# EAGLE schematic vehicle_control_module (EAGLE 9.5.2), part 1 of 2

## Sheet 1 of 16
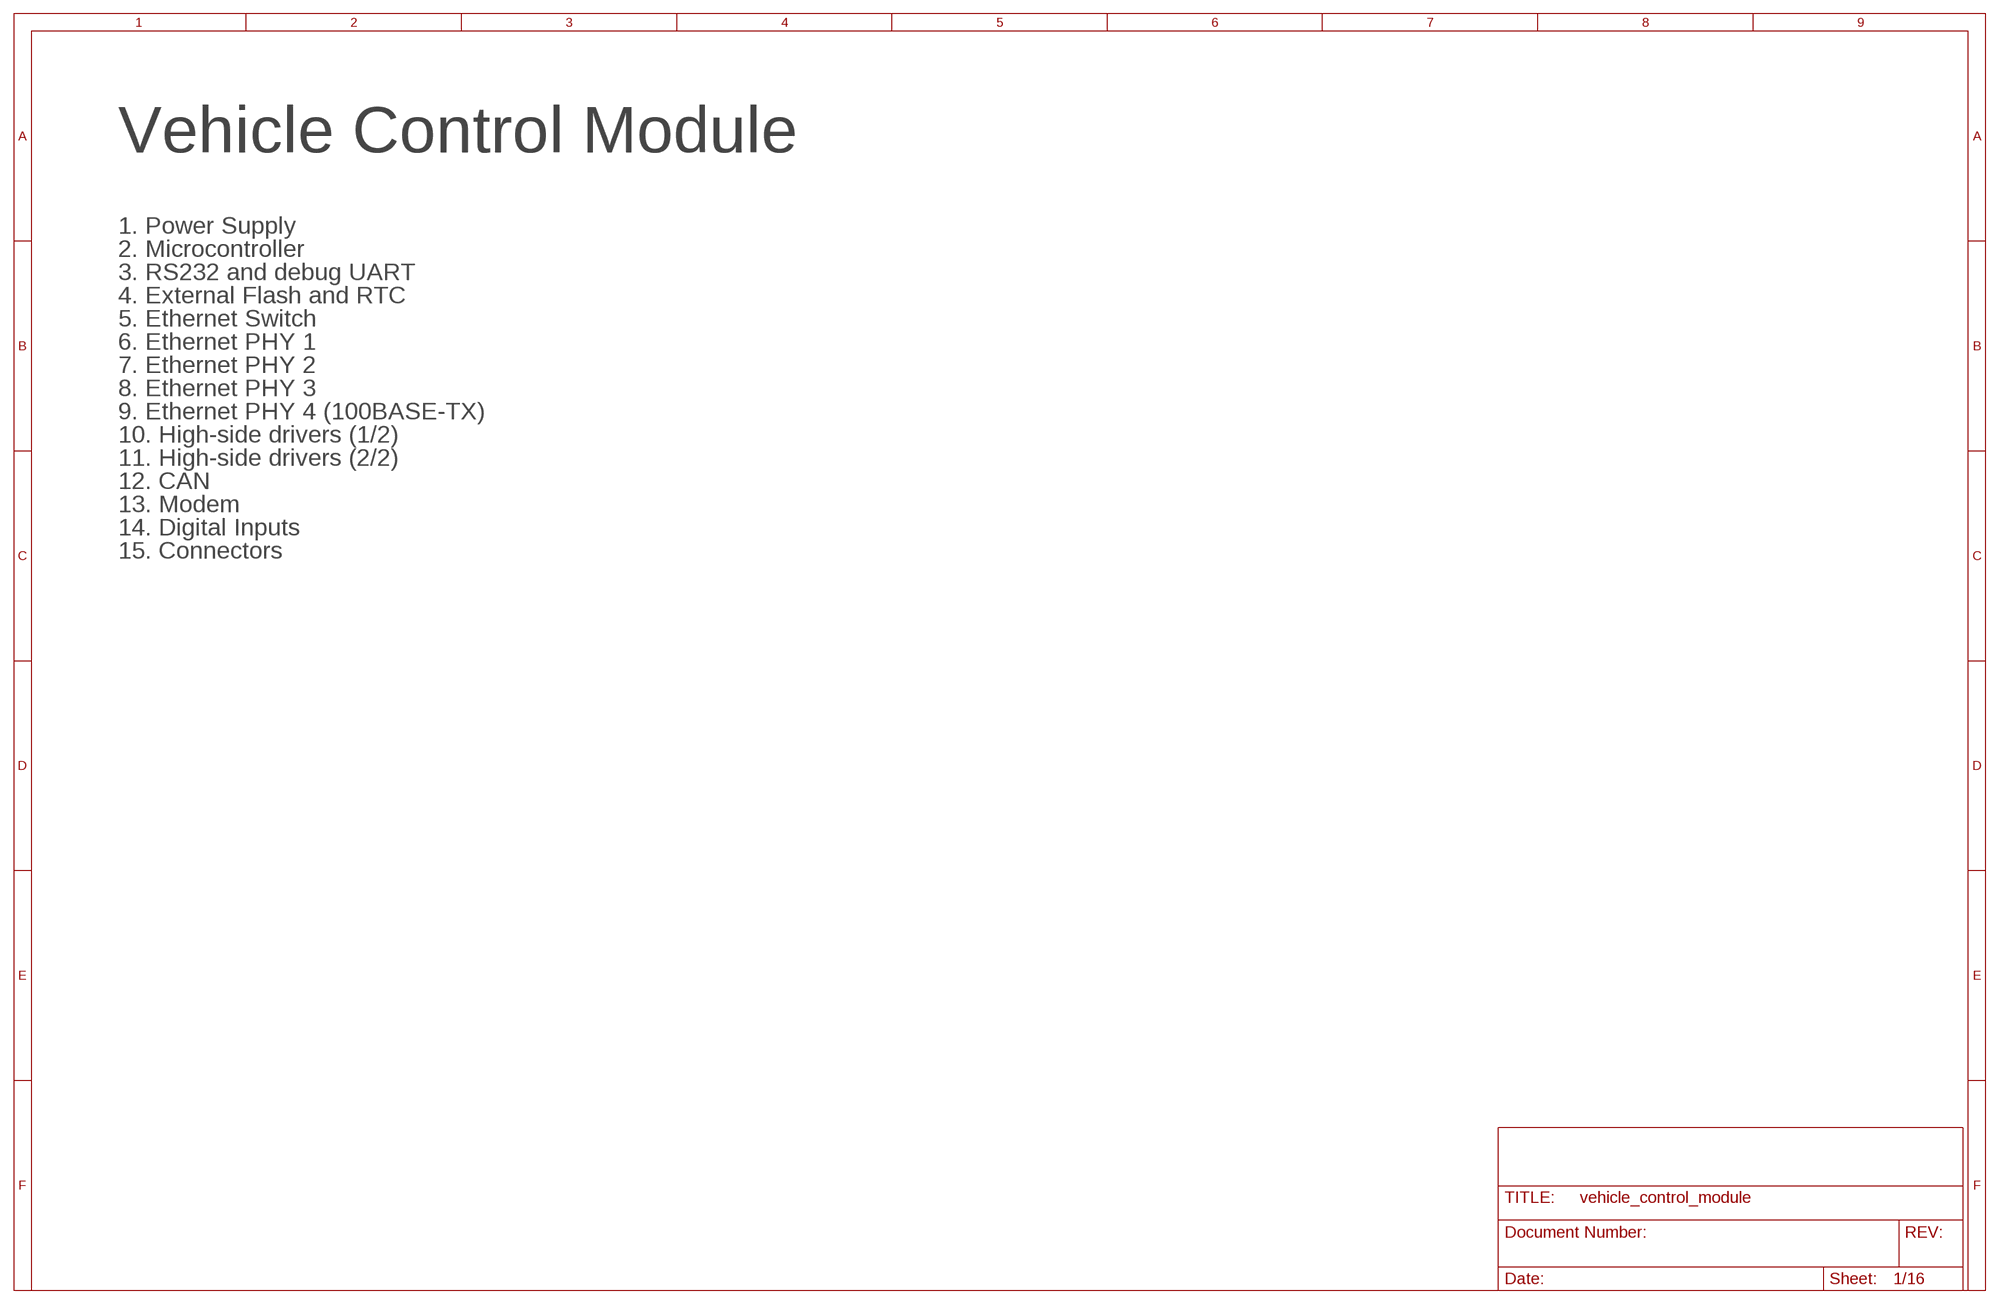
[diagram p0: schematic, sheet 1]

### Notes on the sheet
- Vehicle Control Module
- 1. Power Supply
- 2. Microcontroller
- 3. RS232 and debug UART
- 4. External Flash and RTC
- 5. Ethernet Switch
- 6. Ethernet PHY 1
- 7. Ethernet PHY 2
- 8. Ethernet PHY 3
- 9. Ethernet PHY 4 (100BASE-TX)
- 10. High-side drivers (1/2)
- 11. High-side drivers (2/2)
- 12. CAN
- 13. Modem
- 14. Digital Inputs
- 15. Connectors

## Sheet 2 of 16
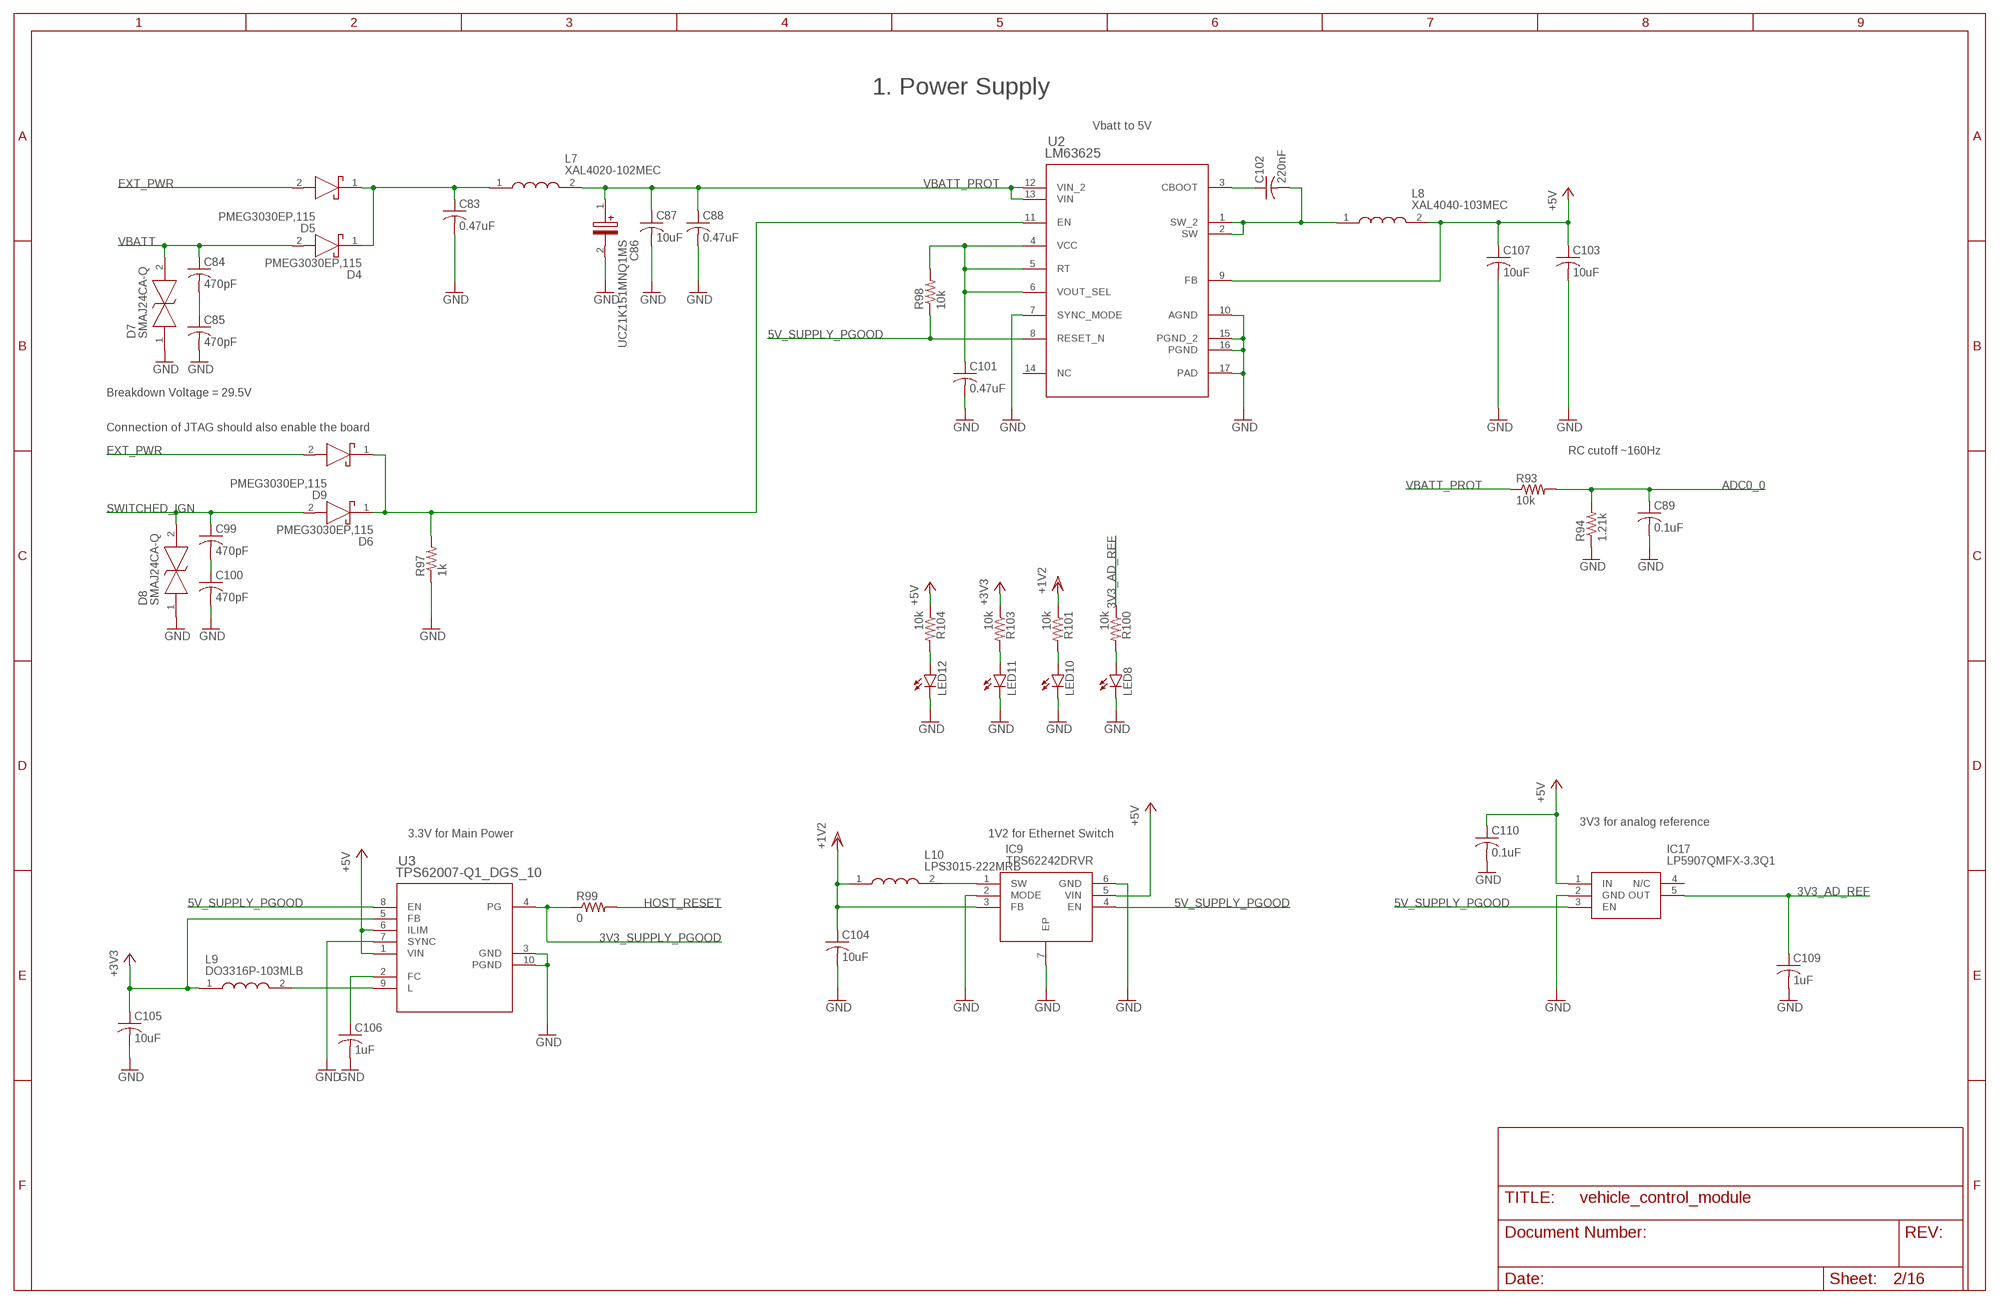
[diagram p1: schematic, sheet 2]

### Parts
C83  0.47uF  C-USC0805  [C0805]
C84  470pF  C-USC0805  [C0805]
C85  470pF  C-USC0805  [C0805]
C86  UCZ1K151MNQ1MS  [CAPAE1360X1450N]
C87  10uF  C-USC0805  [C0805]
C88  0.47uF  C-USC0805  [C0805]
C89  0.1uF  C-USC0603  [C0603]
C99  470pF  C-USC0805  [C0805]
C100  470pF  C-USC0805  [C0805]
C101  0.47uF  C-USC0603  [C0603]
C102  220nF  C-USC0805  [C0805]
C103  10uF  C-USC0805  [C0805]
C104  10uF  C-USC0805  [C0805]
C105  10uF  C-USC0805  [C0805]
C106  1uF  C-USC0603  [C0603]
C107  10uF  C-USC0805  [C0805]
C109  1uF  C-USC0603  [C0603]
C110  0.1uF  C-USC0603  [C0603]
D4  PMEG3030EP,115  [SODFL4725X110N]
D5  PMEG3030EP,115  [SODFL4725X110N]
D6  PMEG3030EP,115  [SODFL4725X110N]
D7  SMAJ24CA-Q  [DIONM5127X229N]
D8  SMAJ24CA-Q  [DIONM5127X229N]
D9  PMEG3030EP,115  [SODFL4725X110N]
IC9  TPS62242DRVR  [SON65P200X200X80-7N]
IC17  LP5907QMFX-3.3Q1  [SOT95P280X145-5N]
L7  XAL4020-102MEC  [XAL40XX]
L8  XAL4040-103MEC  [XAL40XX]
L9  DO3316P-103MLB  [DO3316P103MLB]
L10  LPS3015-222MRB  [LPS3015]
LED8  LEDCHIPLED_0603  [CHIPLED_0603]
LED10  LEDCHIPLED_0603  [CHIPLED_0603]
LED11  LEDCHIPLED_0603  [CHIPLED_0603]
LED12  LEDCHIPLED_0603  [CHIPLED_0603]
R93  10k  R-US_R0603  [R0603]
R94  1.21k  R-US_R0603  [R0603]
R97  1k  R-US_R0805  [R0805]
R98  10k  R-US_R0603  [R0603]
R99  0  R-US_R0603  [R0603]
R100  10k  R-US_R0603  [R0603]
R101  10k  R-US_R0603  [R0603]
R103  10k  R-US_R0603  [R0603]
R104  10k  R-US_R0603  [R0603]
U2  LM63625  LM63625DQPWPRQ1PWP0016K_L  [PWP0016K_L]
U3  TPS62007-Q1_DGS_10  [DGS10]

### Nets
3V3_AD_REF: C109.1 IC17.5(OUT) R100.1 ; also sheet 3
3V3_SUPPLY_PGOOD: R99.1 U3.4(PG)
5V_SUPPLY_PGOOD: IC9.4(EN) IC17.3(EN) R98.1 U2.8(RESET_N) U3.8(EN)
+3V3: C105.1 L9.1 R103.1 U3.5(FB) ; also sheet 3,4,5,6,7,8,9,10,11,12,13,14,15
+5V: C103.1 C107.1 C110.1 IC9.5(VIN) IC17.1(IN) L8.2 R104.1 U2.9(FB) U3.1(VIN) U3.6(ILIM) ; also sheet 13
ADC0_0: C89.1 R93.2 R94.2 ; also sheet 3
EXT_PWR: D5.2(A) D9.2(A) ; also sheet 3
GND: C83.2 C85.2 C86.2(-) C87.2 C88.2 C89.2 C100.2 C101.2 C103.2 C104.2 C105.2 C106.2 C107.2 C109.2 C110.2 D7.1 D8.1 IC9.2(MODE) IC9.6(GND) IC9.7(EP) IC17.2(GND) LED8.C LED10.C LED11.C LED12.C R94.1 R97.1 U2.7(SYNC_MODE) U2.10(AGND) U2.15(PGND_2) U2.16(PGND) U2.17(PAD) U3.3(GND) U3.7(SYNC) U3.10(PGND) ; also sheet 3,4,5,6,7,8,9,10,11,12,13,14,15,16
HOST_RESET: R99.2 ; also sheet 3
N$2: C99.2 C100.1
N$43: D6.1(K) D9.1(K) R97.2 U2.11(EN)
N$80: C83.1 D4.1(K) D5.1(K) L7.1
N$81: C84.2 C85.1
N$83: C101.1 R98.2 U2.4(VCC) U2.5(RT) U2.6(VOUT_SEL)
N$84: L9.2 U3.9(L)
N$85: C102.2 L8.1 U2.1(SW_2) U2.2(SW)
N$86: C106.1 U3.2(FC)
N$87: C102.1 U2.3(CBOOT)
N$88: LED8.A R100.2
N$89: IC9.1(SW) L10.2
N$90: LED10.A R101.2
N$91: LED11.A R103.2
N$93: LED12.A R104.2
SWITCHED_IGN: C99.1 D6.2(A) D8.2
VBATT: C84.1 D4.2(A) D7.2 ; also sheet 11,12
VBATT_PROT: C86.1(+) C87.1 C88.1 L7.2 R93.1 U2.12(VIN_2) U2.13(VIN)
VDD: C104.1 IC9.3(FB) L10.1 R101.1 ; supply symbol labelled +1V2 ; also sheet 6,10
Unconnected: IC17.4(N/C) U2.14(NC)

### Notes on the sheet
- 1. Power Supply
- Vbatt to 5V
- Breakdown Voltage = 29.5V
- Connection of JTAG should also enable the board
- RC cutoff ~160Hz
- 3V3 for analog reference
- 3.3V for Main Power | 1V2 for Ethernet Switch

## Sheet 3 of 16
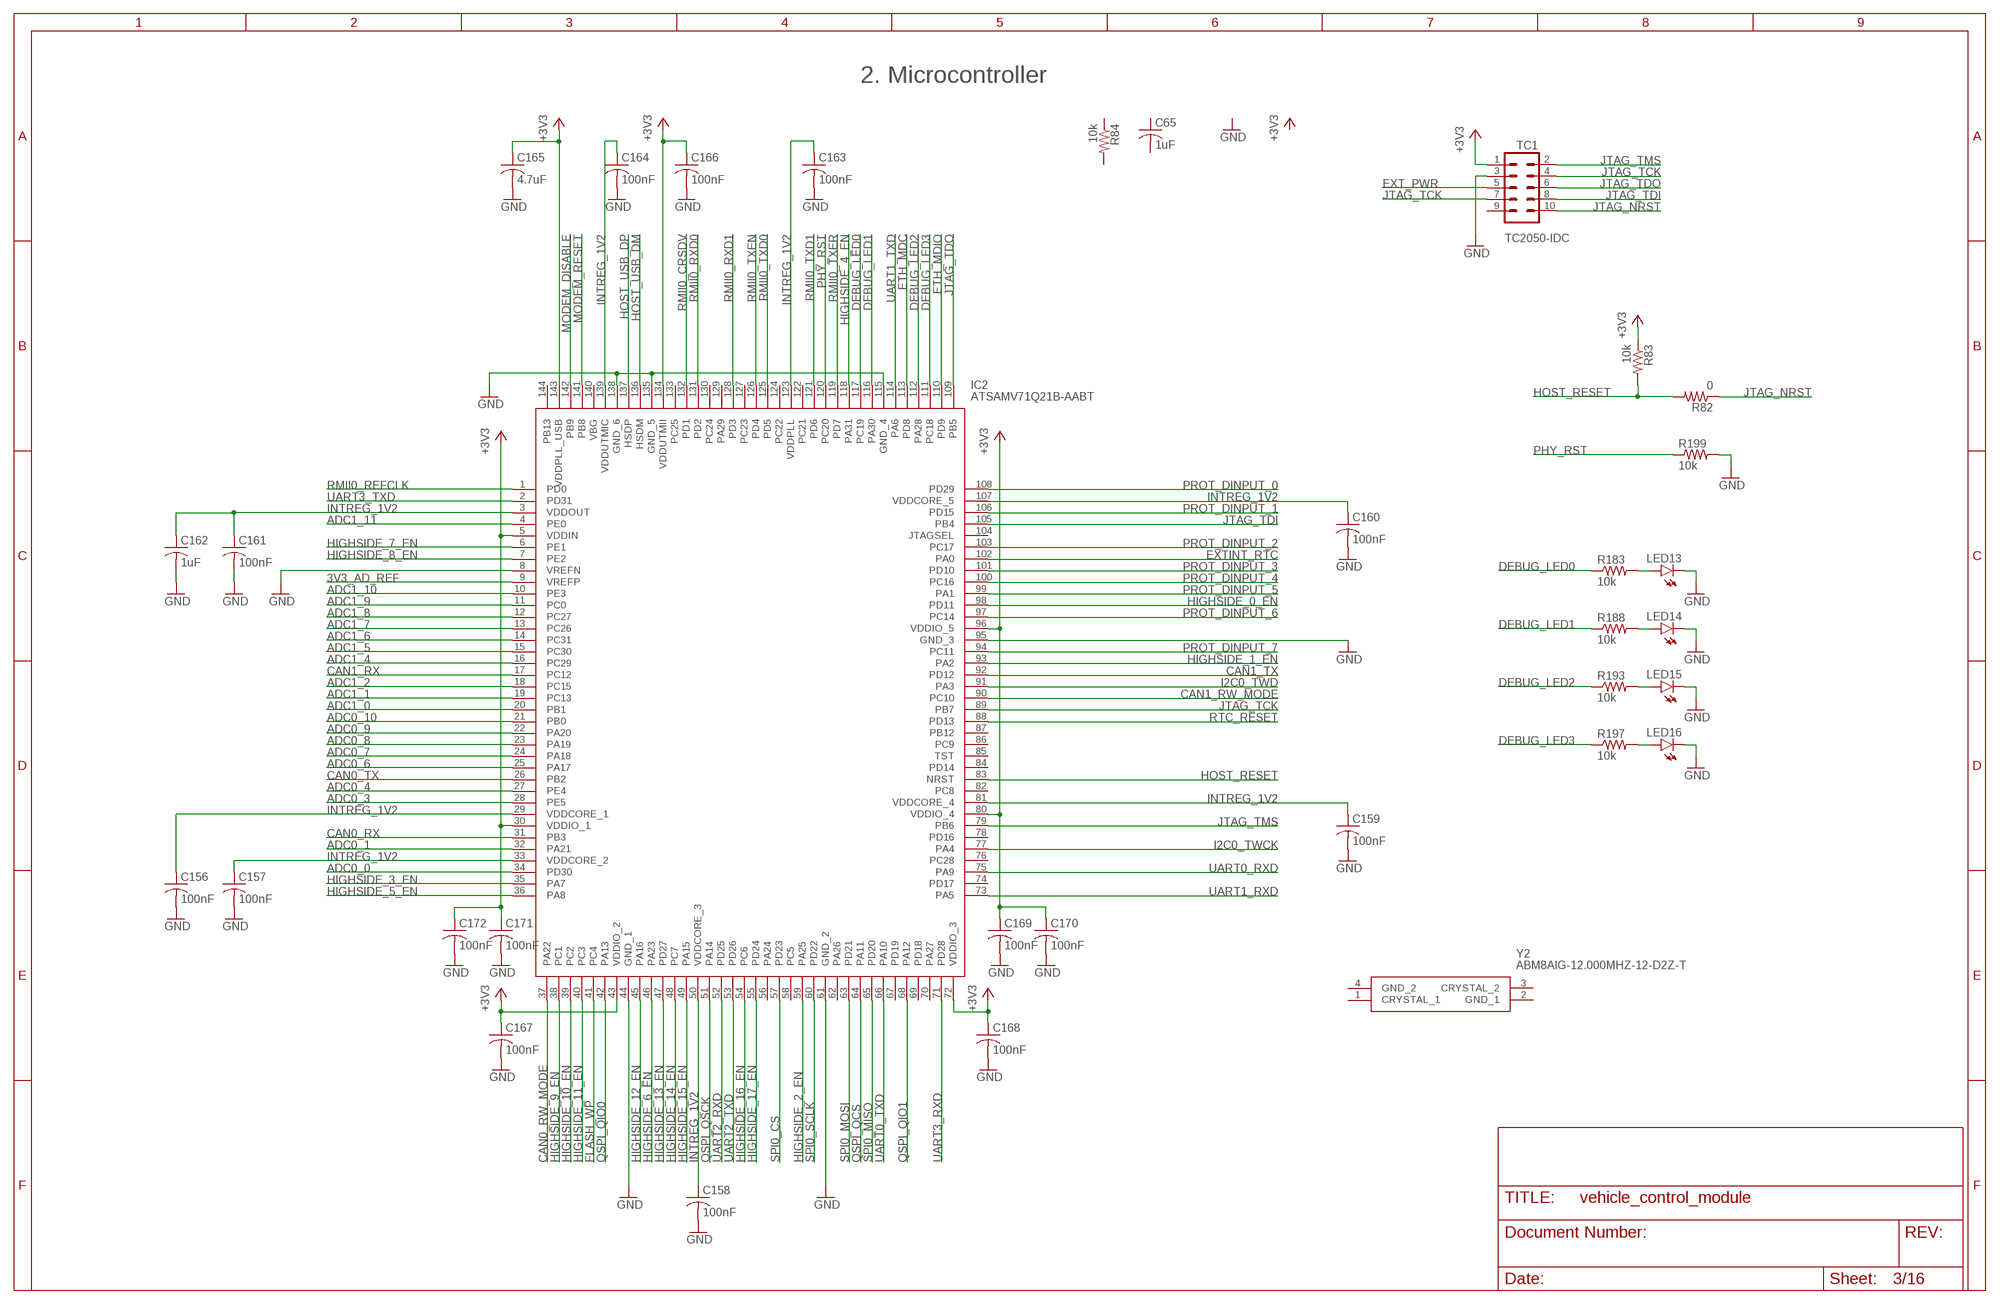
[diagram p2: schematic, sheet 3]

### Parts
C65  1uF  C-USC0603  [C0603]
C156  100nF  C-USC0603  [C0603]
C157  100nF  C-USC0603  [C0603]
C158  100nF  C-USC0603  [C0603]
C159  100nF  C-USC0603  [C0603]
C160  100nF  C-USC0603  [C0603]
C161  100nF  C-USC0603  [C0603]
C162  1uF  C-USC0603  [C0603]
C163  100nF  C-USC0603  [C0603]
C164  100nF  C-USC0603  [C0603]
C165  4.7uF  C-USC0603  [C0603]
C166  100nF  C-USC0603  [C0603]
C167  100nF  C-USC0603  [C0603]
C168  100nF  C-USC0603  [C0603]
C169  100nF  C-USC0603  [C0603]
C170  100nF  C-USC0603  [C0603]
C171  100nF  C-USC0603  [C0603]
C172  100nF  C-USC0603  [C0603]
IC2  ATSAMV71Q21B-AABT  [QFP50P2200X2200X160-144N]
LED13  LEDCHIPLED_0603  [CHIPLED_0603]
LED14  LEDCHIPLED_0603  [CHIPLED_0603]
LED15  LEDCHIPLED_0603  [CHIPLED_0603]
LED16  LEDCHIPLED_0603  [CHIPLED_0603]
R82  0  R-US_R0603  [R0603]
R83  10k  R-US_R0603  [R0603]
R84  10k  R-US_R0603  [R0603]
R183  10k  R-US_R0603  [R0603]
R188  10k  R-US_R0603  [R0603]
R193  10k  R-US_R0603  [R0603]
R197  10k  R-US_R0603  [R0603]
R199  10k  R-US_R0603  [R0603]
TC1  TC2050-IDC  [TC2050-IDC]
Y2  ABM8AIG-12.000MHZ-12-D2Z-T  [ABM8AIG12000MHZ12D2ZT]

### Nets
3V3_AD_REF: IC2.9(VREFP) ; also sheet 2
+3V3: C165.1 C166.1 C167.1 C168.1 C169.1 C170.1 C171.1 C172.1 IC2.5(VDDIN) IC2.30(VDDIO_1) IC2.43(VDDIO_2) IC2.72(VDDIO_3) IC2.80(VDDIO_4) IC2.96(VDDIO_5) IC2.134(VDDUTMII) IC2.143(VDDPLL_USB) R83.1 TC1.1 ; also sheet 2,4,5,6,7,8,9,10,11,12,13,14,15
ADC0_0: IC2.34(PD30) ; also sheet 2
ADC0_1: IC2.32(PA21)
ADC0_3: IC2.28(PE5) ; also sheet 11
ADC0_4: IC2.27(PE4) ; also sheet 11
ADC0_6: IC2.25(PA17) ; also sheet 11
ADC0_7: IC2.24(PA18) ; also sheet 11
ADC0_8: IC2.23(PA19) ; also sheet 11
ADC0_9: IC2.22(PA20) ; also sheet 11
ADC0_10: IC2.21(PB0) ; also sheet 11
ADC1_0: IC2.20(PB1) ; also sheet 11
ADC1_1: IC2.19(PC13) ; also sheet 11
ADC1_2: IC2.18(PC15) ; also sheet 12
ADC1_4: IC2.16(PC29) ; also sheet 12
ADC1_5: IC2.15(PC30) ; also sheet 12
ADC1_6: IC2.14(PC31) ; also sheet 12
ADC1_7: IC2.13(PC26) ; also sheet 12
ADC1_8: IC2.12(PC27) ; also sheet 12
ADC1_9: IC2.11(PC0) ; also sheet 12
ADC1_10: IC2.10(PE3) ; also sheet 12
ADC1_11: IC2.4(PE0) ; also sheet 12
CAN0_RW_MODE: IC2.37(PA22) ; also sheet 13
CAN0_RX: IC2.31(PB3) ; also sheet 13
CAN0_TX: IC2.26(PB2) ; also sheet 13
CAN1_RW_MODE: IC2.90(PC10) ; also sheet 13
CAN1_RX: IC2.17(PC12) ; also sheet 13
CAN1_TX: IC2.92(PD12) ; also sheet 13
DEBUG_LED0: IC2.117(PC19) R183.1
DEBUG_LED1: IC2.116(PA30) R188.1
DEBUG_LED2: IC2.112(PA28) R193.1
DEBUG_LED3: IC2.111(PC18) R197.1
ETH_MDC: IC2.113(PD8) ; also sheet 7,8,9,10
ETH_MDIO: IC2.110(PD9) ; also sheet 7,8,9,10
EXT_PWR: TC1.5 ; also sheet 2
EXTINT_RTC: IC2.102(PA0) ; also sheet 5
FLASH_WP: IC2.41(PC4) ; also sheet 5
GND: C156.2 C157.2 C158.2 C159.2 C160.2 C161.2 C162.2 C163.2 C164.2 C165.2 C166.2 C167.2 C168.2 C169.2 C170.2 C171.2 C172.2 IC2.8(VREFN) IC2.44(GND_1) IC2.61(GND_2) IC2.95(GND_3) IC2.115(GND_4) IC2.135(GND_5) IC2.138(GND_6) LED13.C LED14.C LED15.C LED16.C R199.2 TC1.3 ; also sheet 2,4,5,6,7,8,9,10,11,12,13,14,15,16
HIGHSIDE_0_EN: IC2.98(PD11) ; also sheet 11
HIGHSIDE_1_EN: IC2.93(PA2) ; also sheet 11
HIGHSIDE_2_EN: IC2.59(PA25) ; also sheet 11
HIGHSIDE_3_EN: IC2.35(PA7) ; also sheet 11
HIGHSIDE_4_EN: IC2.118(PA31) ; also sheet 11
HIGHSIDE_5_EN: IC2.36(PA8) ; also sheet 11
HIGHSIDE_6_EN: IC2.46(PA23) ; also sheet 11
HIGHSIDE_7_EN: IC2.6(PE1) ; also sheet 11
HIGHSIDE_8_EN: IC2.7(PE2) ; also sheet 11
HIGHSIDE_9_EN: IC2.38(PC1) ; also sheet 12
HIGHSIDE_10_EN: IC2.39(PC2) ; also sheet 12
HIGHSIDE_11_EN: IC2.40(PC3) ; also sheet 12
HIGHSIDE_12_EN: IC2.45(PA16) ; also sheet 12
HIGHSIDE_13_EN: IC2.47(PD27) ; also sheet 12
HIGHSIDE_14_EN: IC2.48(PC7) ; also sheet 12
HIGHSIDE_15_EN: IC2.49(PA15) ; also sheet 12
HIGHSIDE_16_EN: IC2.54(PC6) ; also sheet 12
HIGHSIDE_17_EN: IC2.55(PD24) ; also sheet 12
HOST_RESET: IC2.83(NRST) R82.2 R83.2 ; also sheet 2
HOST_USB_DM: IC2.136(HSDM) ; also sheet 14
HOST_USB_DP: IC2.137(HSDP) ; also sheet 14
I2C0_TWCK: IC2.77(PA4) ; also sheet 5
I2C0_TWD: IC2.91(PA3) ; also sheet 5
INTREG_1V2: C156.1 C157.1 C158.1 C159.1 C160.1 C161.1 C162.1 C163.1 C164.1 IC2.3(VDDOUT) IC2.29(VDDCORE_1) IC2.33(VDDCORE_2) IC2.50(VDDCORE_3) IC2.81(VDDCORE_4) IC2.107(VDDCORE_5) IC2.123(VDDPLL) IC2.139(VDDUTMIC)
JTAG_NRST: R82.1 TC1.10
JTAG_TCK: IC2.89(PB7) TC1.4 TC1.7
JTAG_TDI: IC2.105(PB4) TC1.8
JTAG_TDO: IC2.109(PB5) TC1.6
JTAG_TMS: IC2.79(PB6) TC1.2
MODEM_DISABLE: IC2.142(PB9) ; also sheet 14
MODEM_RESET: IC2.141(PB8) ; also sheet 14
N$22: LED13.A R183.2
N$23: LED14.A R188.2
N$156: LED15.A R193.2
N$157: LED16.A R197.2
PHY_RST: IC2.120(PC20) R199.1 ; also sheet 7,8,9
PROT_DINPUT_0: IC2.108(PD29) ; also sheet 15
PROT_DINPUT_1: IC2.106(PD15) ; also sheet 15
PROT_DINPUT_2: IC2.103(PC17) ; also sheet 15
PROT_DINPUT_3: IC2.101(PD10) ; also sheet 15
PROT_DINPUT_4: IC2.100(PC16) ; also sheet 15
PROT_DINPUT_5: IC2.99(PA1) ; also sheet 15
PROT_DINPUT_6: IC2.97(PC14) ; also sheet 15
PROT_DINPUT_7: IC2.94(PC11) ; also sheet 15
QSPI_QCS: IC2.64(PA11) ; also sheet 5
QSPI_QIO0: IC2.42(PA13) ; also sheet 5
QSPI_QIO1: IC2.68(PA12) ; also sheet 5
QSPI_QSCK: IC2.51(PA14) ; also sheet 5
RMII0_CRSDV: IC2.132(PD1) ; also sheet 6
RMII0_REFCLK: IC2.1(PD0) ; also sheet 6
RMII0_RXD0: IC2.131(PD2) ; also sheet 6
RMII0_RXD1: IC2.128(PD3) ; also sheet 6
RMII0_TXD0: IC2.125(PD5) ; also sheet 6
RMII0_TXD1: IC2.121(PD6) ; also sheet 6
RMII0_TXEN: IC2.126(PD4) ; also sheet 6
RMII0_TXER: IC2.119(PD7) ; also sheet 6
RTC_RESET: IC2.88(PD13) ; also sheet 5
SPI0_CS: IC2.57(PD23) ; also sheet 6
SPI0_MISO: IC2.65(PD20) ; also sheet 6
SPI0_MOSI: IC2.63(PD21) ; also sheet 6
SPI0_SCLK: IC2.60(PD22) ; also sheet 6
UART0_RXD: IC2.75(PA9) ; also sheet 4
UART0_TXD: IC2.66(PA10) ; also sheet 4
UART1_RXD: IC2.73(PA5) ; also sheet 4
UART1_TXD: IC2.114(PA6) ; also sheet 4
UART2_RXD: IC2.52(PD25) ; also sheet 4
UART2_TXD: IC2.53(PD26) ; also sheet 4
UART3_RXD: IC2.71(PD28) ; also sheet 4
UART3_TXD: IC2.2(PD31) ; also sheet 4
Unconnected: C65.1 C65.2 IC2.56(PA24) IC2.58(PC5) IC2.62(PA26) IC2.67(PD19) IC2.69(PD18) IC2.70(PA27) IC2.74(PD17) IC2.76(PC28) IC2.78(PD16) IC2.82(PC8) IC2.84(PD14) IC2.85(TST) IC2.86(PC9) IC2.87(PB12) IC2.104(JTAGSEL) IC2.122(PC21) IC2.124(PC22) IC2.127(PC23) IC2.129(PA29) IC2.130(PC24) IC2.133(PC25) IC2.140(VBG) IC2.144(PB13) R84.1 R84.2 TC1.9 Y2.1(CRYSTAL_1) Y2.2(GND_1) Y2.3(CRYSTAL_2) Y2.4(GND_2)

### Notes on the sheet
- 2. Microcontroller

## Sheet 4 of 16
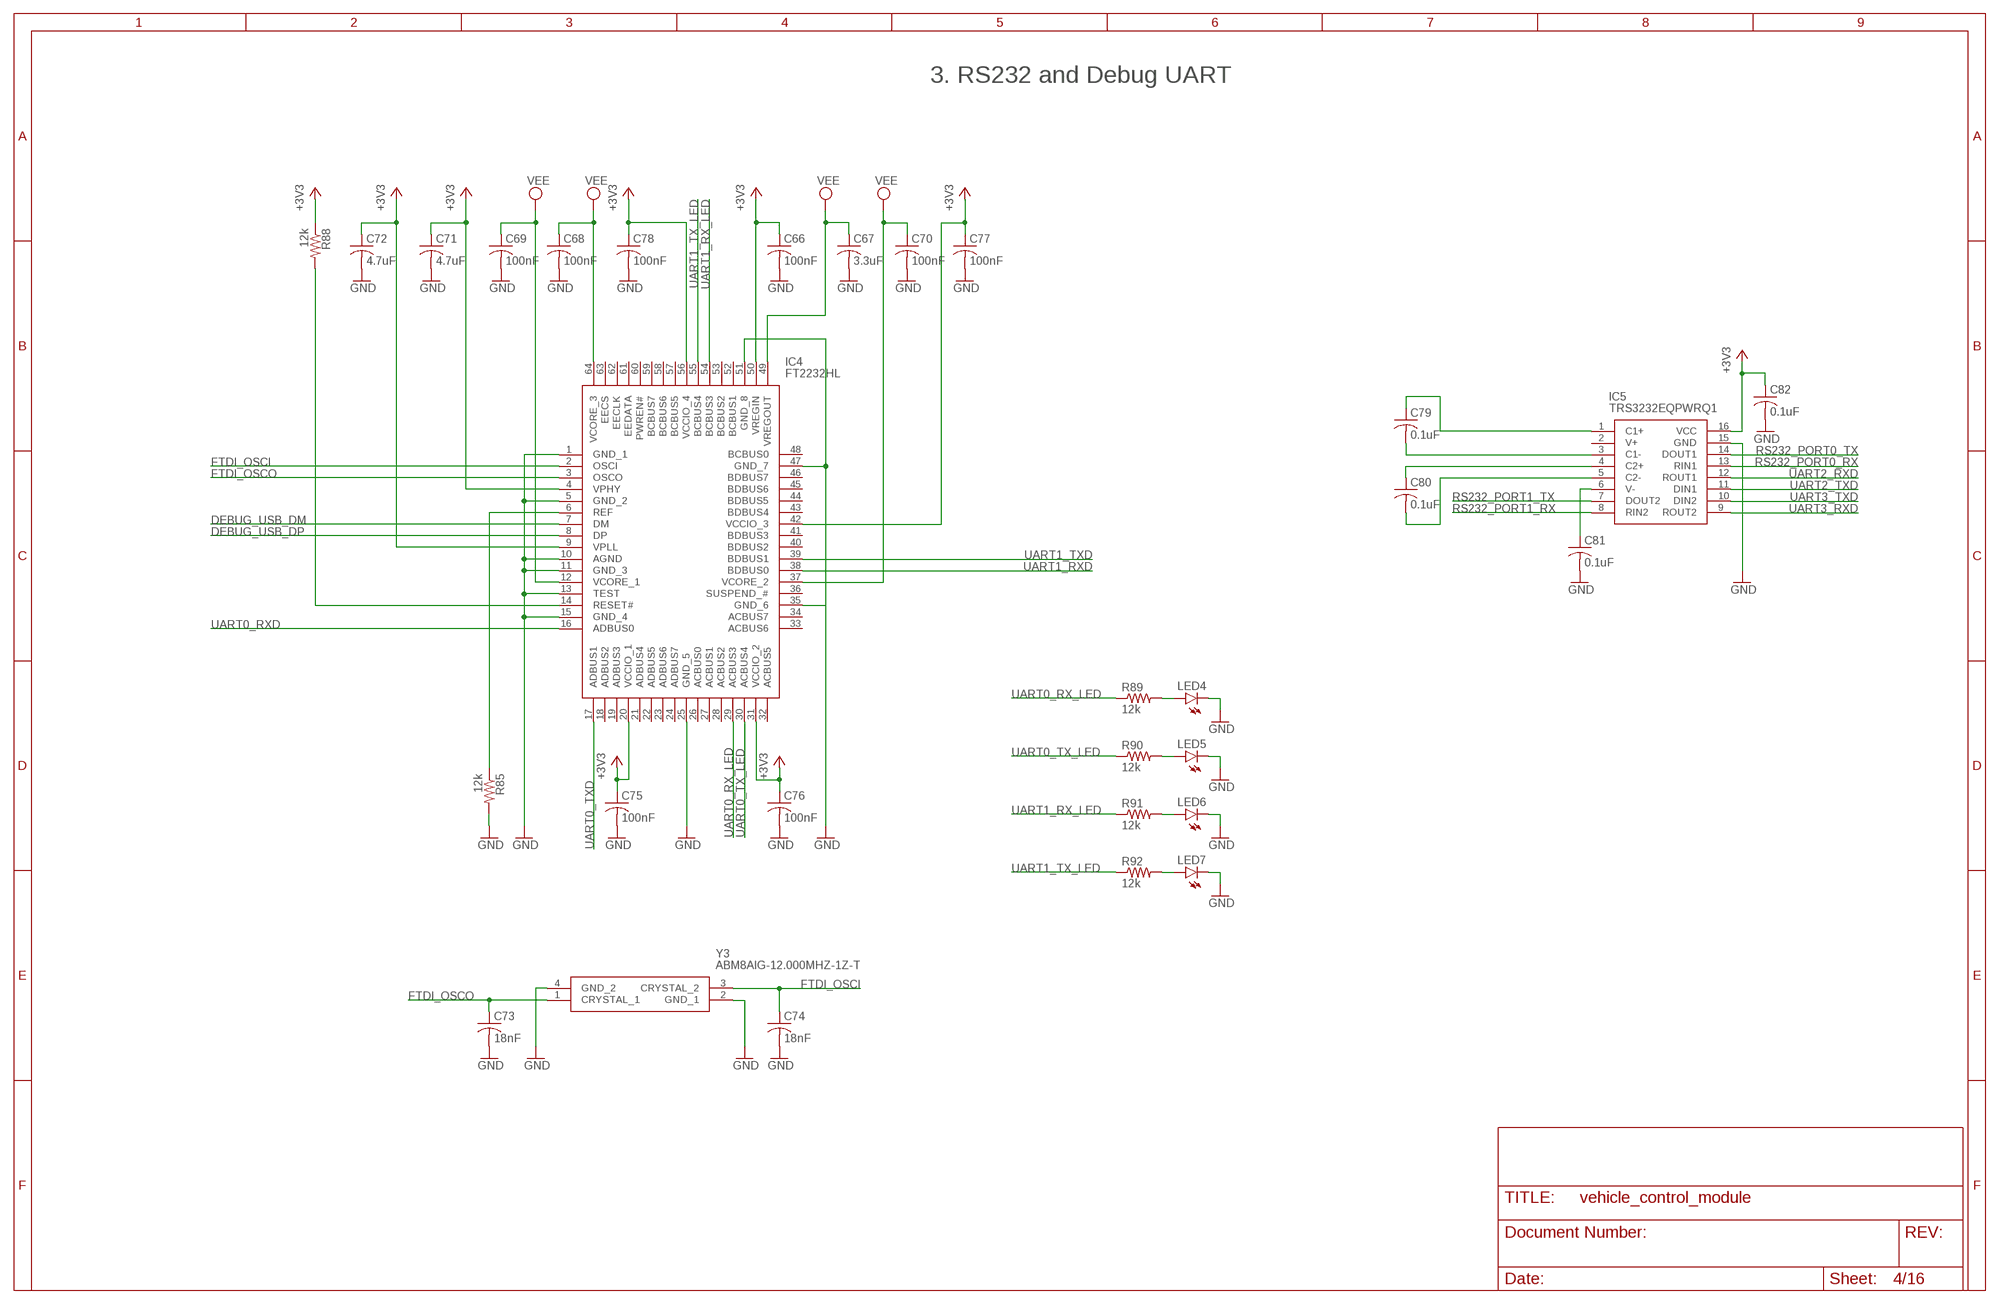
[diagram p3: schematic, sheet 4]

### Parts
C66  100nF  C-USC0603  [C0603]
C67  3.3uF  C-USC0603  [C0603]
C68  100nF  C-USC0603  [C0603]
C69  100nF  C-USC0603  [C0603]
C70  100nF  C-USC0603  [C0603]
C71  4.7uF  C-USC0603  [C0603]
C72  4.7uF  C-USC0603  [C0603]
C73  18nF  C-USC0603  [C0603]
C74  18nF  C-USC0603  [C0603]
C75  100nF  C-USC0603  [C0603]
C76  100nF  C-USC0603  [C0603]
C77  100nF  C-USC0603  [C0603]
C78  100nF  C-USC0603  [C0603]
C79  0.1uF  C-USC0603  [C0603]
C80  0.1uF  C-USC0603  [C0603]
C81  0.1uF  C-USC0603  [C0603]
C82  0.1uF  C-USC0603  [C0603]
IC4  FT2232HL  [QFP50P1200X1200X160-64N]
IC5  TRS3232EQPWRQ1  [SOP65P640X120-16N]
LED4  LEDCHIPLED_0603  [CHIPLED_0603]
LED5  LEDCHIPLED_0603  [CHIPLED_0603]
LED6  LEDCHIPLED_0603  [CHIPLED_0603]
LED7  LEDCHIPLED_0603  [CHIPLED_0603]
R85  12k  R-US_R0603  [R0603]
R88  12k  R-US_R0603  [R0603]
R89  12k  R-US_R0603  [R0603]
R90  12k  R-US_R0603  [R0603]
R91  12k  R-US_R0603  [R0603]
R92  12k  R-US_R0603  [R0603]
Y3  ABM8AIG-12.000MHZ-1Z-T  [ABM8AIG25000MHZ122ZT3]

### Nets
+3V3: C66.1 C71.1 C72.1 C75.1 C76.1 C77.1 C78.1 C82.1 IC4.4(VPHY) IC4.9(VPLL) IC4.20(VCCIO_1) IC4.31(VCCIO_2) IC4.42(VCCIO_3) IC4.50(VREGIN) IC4.56(VCCIO_4) IC5.16(VCC) R88.1 ; also sheet 2,3,5,6,7,8,9,10,11,12,13,14,15
DEBUG_USB_DM: IC4.7(DM) ; also sheet 16
DEBUG_USB_DP: IC4.8(DP) ; also sheet 16
FTDI_OSCI: C74.1 IC4.2(OSCI) Y3.3(CRYSTAL_2)
FTDI_OSCO: C73.1 IC4.3(OSCO) Y3.1(CRYSTAL_1)
GND: C66.2 C67.2 C68.2 C69.2 C70.2 C71.2 C72.2 C73.2 C74.2 C75.2 C76.2 C77.2 C78.2 C81.2 C82.2 IC4.1(GND_1) IC4.5(GND_2) IC4.10(AGND) IC4.11(GND_3) IC4.13(TEST) IC4.15(GND_4) IC4.25(GND_5) IC4.35(GND_6) IC4.47(GND_7) IC4.51(GND_8) IC5.15(GND) LED4.C LED5.C LED6.C LED7.C R85.2 Y3.2(GND_1) Y3.4(GND_2) ; also sheet 2,3,5,6,7,8,9,10,11,12,13,14,15,16
N$69: IC4.6(REF) R85.1
N$70: IC4.14(RESET#) R88.2
N$71: LED5.A R90.2
N$72: LED4.A R89.2
N$73: LED6.A R91.2
N$74: LED7.A R92.2
N$75: C79.1 IC5.1(C1+)
N$76: C79.2 IC5.3(C1-)
N$77: C80.1 IC5.4(C2+)
N$78: C80.2 IC5.5(C2-)
N$79: C81.1 IC5.6(V-)
RS232_PORT0_RX: IC5.13(RIN1) ; also sheet 16
RS232_PORT0_TX: IC5.14(DOUT1) ; also sheet 16
RS232_PORT1_RX: IC5.8(RIN2) ; also sheet 16
RS232_PORT1_TX: IC5.7(DOUT2) ; also sheet 16
UART0_RX_LED: IC4.29(ACBUS3) R89.1
UART0_RXD: IC4.16(ADBUS0) ; also sheet 3
UART0_TX_LED: IC4.30(ACBUS4) R90.1
UART0_TXD: IC4.17(ADBUS1) ; also sheet 3
UART1_RX_LED: IC4.54(BCBUS3) R91.1
UART1_RXD: IC4.38(BDBUS0) ; also sheet 3
UART1_TX_LED: IC4.55(BCBUS4) R92.1
UART1_TXD: IC4.39(BDBUS1) ; also sheet 3
UART2_RXD: IC5.12(ROUT1) ; also sheet 3
UART2_TXD: IC5.11(DIN1) ; also sheet 3
UART3_RXD: IC5.9(ROUT2) ; also sheet 3
UART3_TXD: IC5.10(DIN2) ; also sheet 3
VEE: C67.1 C68.1 C69.1 C70.1 IC4.12(VCORE_1) IC4.37(VCORE_2) IC4.49(VREGOUT) IC4.64(VCORE_3)
Unconnected: IC4.18(ADBUS2) IC4.19(ADBUS3) IC4.21(ADBUS4) IC4.22(ADBUS5) IC4.23(ADBUS6) IC4.24(ADBUS7) IC4.26(ACBUS0) IC4.27(ACBUS1) IC4.28(ACBUS2) IC4.32(ACBUS5) IC4.33(ACBUS6) IC4.34(ACBUS7) IC4.36(SUSPEND_#) IC4.40(BDBUS2) IC4.41(BDBUS3) IC4.43(BDBUS4) IC4.44(BDBUS5) IC4.45(BDBUS6) IC4.46(BDBUS7) IC4.48(BCBUS0) IC4.52(BCBUS1) IC4.53(BCBUS2) IC4.57(BCBUS5) IC4.58(BCBUS6) IC4.59(BCBUS7) IC4.60(PWREN#) IC4.61(EEDATA) IC4.62(EECLK) IC4.63(EECS) IC5.2(V+)

### Notes on the sheet
- 3. RS232 and Debug UART

## Sheet 5 of 16
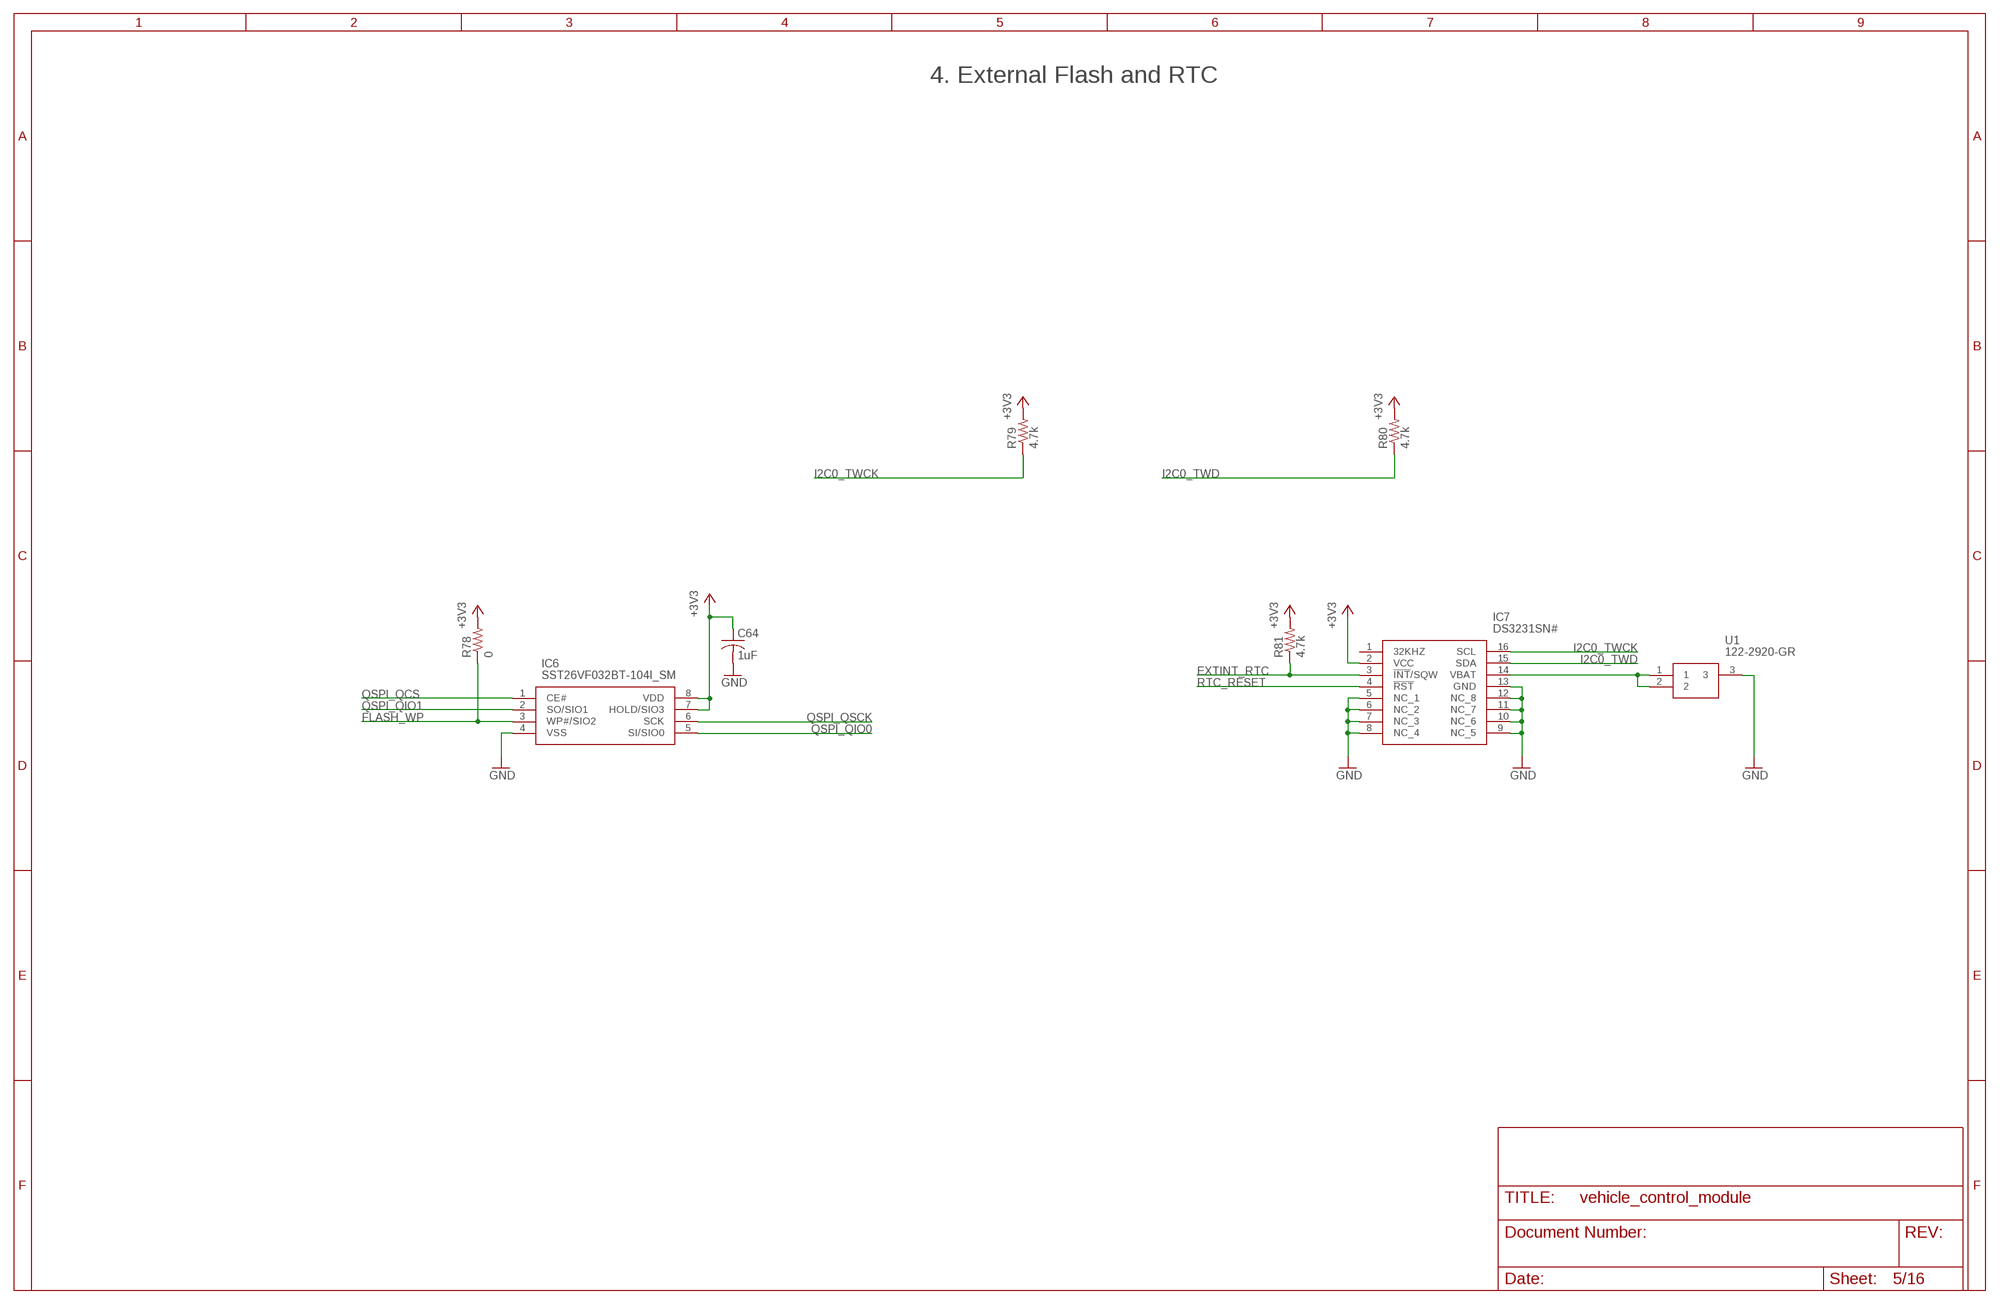
[diagram p4: schematic, sheet 5]

### Parts
C64  1uF  C-USC0603  [C0603]
IC6  SST26VF032BT-104I_SM  [SOIC127P794X203-8N]
IC7  DS3231SN#  [SOIC127P1032X265-16N]
R78  0  R-US_R0603  [R0603]
R79  4.7k  R-US_R0603  [R0603]
R80  4.7k  R-US_R0603  [R0603]
R81  4.7k  R-US_R0603  [R0603]
U1  122-2920-GR  [1222920GR]

### Nets
+3V3: C64.1 IC6.7(HOLD/SIO3) IC6.8(VDD) IC7.2(VCC) R78.2 R79.2 R80.2 R81.2 ; also sheet 2,3,4,6,7,8,9,10,11,12,13,14,15
EXTINT_RTC: IC7.3(!INT!/SQW) R81.1 ; also sheet 3
FLASH_WP: IC6.3(WP#/SIO2) R78.1 ; also sheet 3
GND: C64.2 IC6.4(VSS) IC7.5(NC_1) IC7.6(NC_2) IC7.7(NC_3) IC7.8(NC_4) IC7.9(NC_5) IC7.10(NC_6) IC7.11(NC_7) IC7.12(NC_8) IC7.13(GND) U1.3 ; also sheet 2,3,4,6,7,8,9,10,11,12,13,14,15,16
I2C0_TWCK: IC7.16(SCL) R79.1 ; also sheet 3
I2C0_TWD: IC7.15(SDA) R80.1 ; also sheet 3
N$1: IC7.14(VBAT) U1.1 U1.2
QSPI_QCS: IC6.1(CE#) ; also sheet 3
QSPI_QIO0: IC6.5(SI/SIO0) ; also sheet 3
QSPI_QIO1: IC6.2(SO/SIO1) ; also sheet 3
QSPI_QSCK: IC6.6(SCK) ; also sheet 3
RTC_RESET: IC7.4(!RST) ; also sheet 3
Unconnected: IC7.1(32KHZ)

### Notes on the sheet
- 4. External Flash and RTC

## Sheet 6 of 16
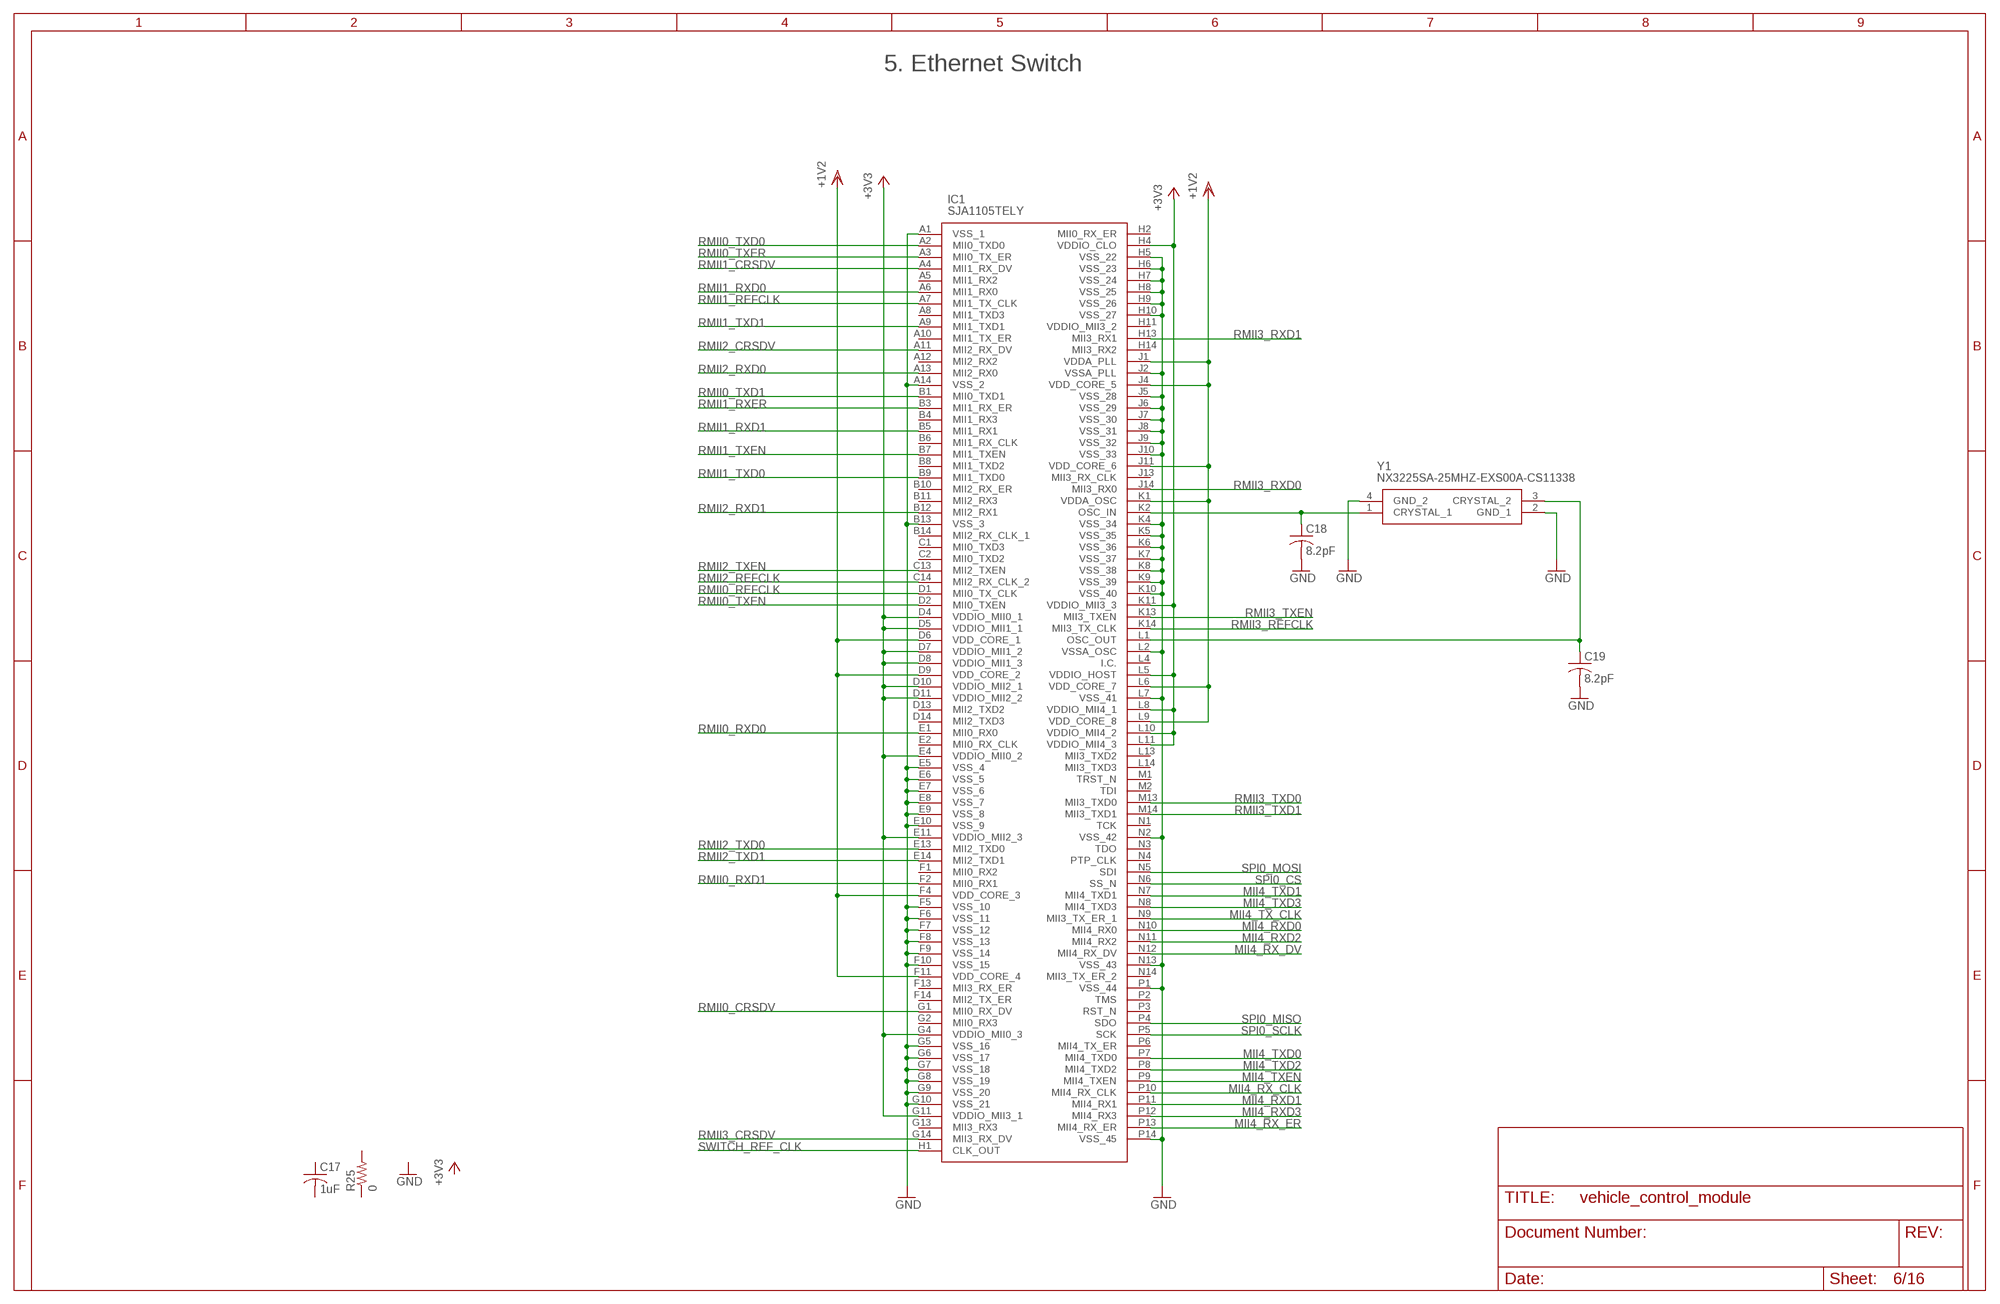
[diagram p5: schematic, sheet 6]

### Parts
C17  1uF  C-USC0603  [C0603]
C18  8.2pF  C-USC0603  [C0603]
C19  8.2pF  C-USC0603  [C0603]
IC1  SJA1105TELY  [BGA159C80P14X14_1200X1200X150]
R25  0  R-US_R0603  [R0603]
Y1  NX3225SA-25MHZ-EXS00A-CS11338  [NX3225SA25MHZEXS00ACS11338]

### Nets
+3V3: IC1.D4(VDDIO_MII0_1) IC1.D5(VDDIO_MII1_1) IC1.D7(VDDIO_MII1_2) IC1.D8(VDDIO_MII1_3) IC1.D10(VDDIO_MII2_1) IC1.D11(VDDIO_MII2_2) IC1.E4(VDDIO_MII0_2) IC1.E11(VDDIO_MII2_3) IC1.G4(VDDIO_MII0_3) IC1.G11(VDDIO_MII3_1) IC1.H4(VDDIO_CLO) IC1.K11(VDDIO_MII3_3) IC1.L5(VDDIO_HOST) IC1.L8(VDDIO_MII4_1) IC1.L10(VDDIO_MII4_2) IC1.L11(VDDIO_MII4_3) ; also sheet 2,3,4,5,7,8,9,10,11,12,13,14,15
GND: C18.2 C19.2 IC1.A1(VSS_1) IC1.A14(VSS_2) IC1.B13(VSS_3) IC1.E5(VSS_4) IC1.E6(VSS_5) IC1.E7(VSS_6) IC1.E8(VSS_7) IC1.E9(VSS_8) IC1.E10(VSS_9) IC1.F5(VSS_10) IC1.F6(VSS_11) IC1.F7(VSS_12) IC1.F8(VSS_13) IC1.F9(VSS_14) IC1.F10(VSS_15) IC1.G5(VSS_16) IC1.G6(VSS_17) IC1.G7(VSS_18) IC1.G8(VSS_19) IC1.G9(VSS_20) IC1.G10(VSS_21) IC1.H5(VSS_22) IC1.H6(VSS_23) IC1.H7(VSS_24) IC1.H8(VSS_25) IC1.H9(VSS_26) IC1.H10(VSS_27) IC1.J2(VSSA_PLL) IC1.J5(VSS_28) IC1.J6(VSS_29) IC1.J7(VSS_30) IC1.J8(VSS_31) IC1.J9(VSS_32) IC1.J10(VSS_33) IC1.K4(VSS_34) IC1.K5(VSS_35) IC1.K6(VSS_36) IC1.K7(VSS_37) IC1.K8(VSS_38) IC1.K9(VSS_39) IC1.K10(VSS_40) IC1.L2(VSSA_OSC) IC1.L7(VSS_41) IC1.N2(VSS_42) IC1.N13(VSS_43) IC1.P1(VSS_44) IC1.P14(VSS_45) Y1.2(GND_1) Y1.4(GND_2) ; also sheet 2,3,4,5,7,8,9,10,11,12,13,14,15,16
MII4_RX_CLK: IC1.P10(MII4_RX_CLK) ; also sheet 10
MII4_RX_DV: IC1.N12(MII4_RX_DV) ; also sheet 10
MII4_RX_ER: IC1.P13(MII4_RX_ER)
MII4_RXD0: IC1.N10(MII4_RX0) ; also sheet 10
MII4_RXD1: IC1.P11(MII4_RX1) ; also sheet 10
MII4_RXD2: IC1.N11(MII4_RX2) ; also sheet 10
MII4_RXD3: IC1.P12(MII4_RX3) ; also sheet 10
MII4_TX_CLK: IC1.N9(MII3_TX_ER_1) ; also sheet 10
MII4_TXD0: IC1.P7(MII4_TXD0) ; also sheet 10
MII4_TXD1: IC1.N7(MII4_TXD1) ; also sheet 10
MII4_TXD2: IC1.P8(MII4_TXD2) ; also sheet 10
MII4_TXD3: IC1.N8(MII4_TXD3) ; also sheet 10
MII4_TXEN: IC1.P9(MII4_TXEN) ; also sheet 10
N$20: C18.1 IC1.K2(OSC_IN) Y1.1(CRYSTAL_1)
N$21: C19.1 IC1.L1(OSC_OUT) Y1.3(CRYSTAL_2)
RMII0_CRSDV: IC1.G1(MII0_RX_DV) ; also sheet 3
RMII0_REFCLK: IC1.D1(MII0_TX_CLK) ; also sheet 3
RMII0_RXD0: IC1.E1(MII0_RX0) ; also sheet 3
RMII0_RXD1: IC1.F2(MII0_RX1) ; also sheet 3
RMII0_TXD0: IC1.A2(MII0_TXD0) ; also sheet 3
RMII0_TXD1: IC1.B1(MII0_TXD1) ; also sheet 3
RMII0_TXEN: IC1.D2(MII0_TXEN) ; also sheet 3
RMII0_TXER: IC1.A3(MII0_TX_ER) ; also sheet 3
RMII1_CRSDV: IC1.A4(MII1_RX_DV) ; also sheet 7
RMII1_REFCLK: IC1.A7(MII1_TX_CLK) ; also sheet 7
RMII1_RXD0: IC1.A6(MII1_RX0) ; also sheet 7
RMII1_RXD1: IC1.B5(MII1_RX1) ; also sheet 7
RMII1_RXER: IC1.B3(MII1_RX_ER) ; also sheet 7
RMII1_TXD0: IC1.B9(MII1_TXD0) ; also sheet 7
RMII1_TXD1: IC1.A9(MII1_TXD1) ; also sheet 7
RMII1_TXEN: IC1.B7(MII1_TXEN)
RMII2_CRSDV: IC1.A11(MII2_RX_DV) ; also sheet 8
RMII2_REFCLK: IC1.C14(MII2_RX_CLK_2) ; also sheet 8
RMII2_RXD0: IC1.A13(MII2_RX0) ; also sheet 8
RMII2_RXD1: IC1.B12(MII2_RX1) ; also sheet 8
RMII2_TXD0: IC1.E13(MII2_TXD0) ; also sheet 8
RMII2_TXD1: IC1.E14(MII2_TXD1) ; also sheet 8
RMII2_TXEN: IC1.C13(MII2_TXEN)
RMII3_CRSDV: IC1.G14(MII3_RX_DV) ; also sheet 9
RMII3_REFCLK: IC1.K14(MII3_TX_CLK) ; also sheet 9
RMII3_RXD0: IC1.J14(MII3_RX0) ; also sheet 9
RMII3_RXD1: IC1.H13(MII3_RX1) ; also sheet 9
RMII3_TXD0: IC1.M13(MII3_TXD0) ; also sheet 9
RMII3_TXD1: IC1.M14(MII3_TXD1) ; also sheet 9
RMII3_TXEN: IC1.K13(MII3_TXEN)
SPI0_CS: IC1.N6(SS_N) ; also sheet 3
SPI0_MISO: IC1.P4(SDO) ; also sheet 3
SPI0_MOSI: IC1.N5(SDI) ; also sheet 3
SPI0_SCLK: IC1.P5(SCK) ; also sheet 3
SWITCH_REF_CLK: IC1.H1(CLK_OUT) ; also sheet 10
VDD: IC1.D6(VDD_CORE_1) IC1.D9(VDD_CORE_2) IC1.F4(VDD_CORE_3) IC1.F11(VDD_CORE_4) IC1.J1(VDDA_PLL) IC1.J4(VDD_CORE_5) IC1.J11(VDD_CORE_6) IC1.K1(VDDA_OSC) IC1.L6(VDD_CORE_7) IC1.L9(VDD_CORE_8) ; supply symbol labelled +1V2 ; also sheet 2,10
Unconnected: C17.1 C17.2 IC1.A5(MII1_RX2) IC1.A8(MII1_TXD3) IC1.A10(MII1_TX_ER) IC1.A12(MII2_RX2) IC1.B4(MII1_RX3) IC1.B6(MII1_RX_CLK) IC1.B8(MII1_TXD2) IC1.B10(MII2_RX_ER) IC1.B11(MII2_RX3) IC1.B14(MII2_RX_CLK_1) IC1.C1(MII0_TXD3) IC1.C2(MII0_TXD2) IC1.D13(MII2_TXD2) IC1.D14(MII2_TXD3) IC1.E2(MII0_RX_CLK) IC1.F1(MII0_RX2) IC1.F13(MII3_RX_ER) IC1.F14(MII2_TX_ER) IC1.G2(MII0_RX3) IC1.G13(MII3_RX3) IC1.H2(MII0_RX_ER) IC1.H11(VDDIO_MII3_2) IC1.H14(MII3_RX2) IC1.J13(MII3_RX_CLK) IC1.L4(I.C.) IC1.L13(MII3_TXD2) IC1.L14(MII3_TXD3) IC1.M1(TRST_N) IC1.M2(TDI) IC1.N1(TCK) IC1.N3(TDO) IC1.N4(PTP_CLK) IC1.N14(MII3_TX_ER_2) IC1.P2(TMS) IC1.P3(RST_N) IC1.P6(MII4_TX_ER) R25.1 R25.2

### Notes on the sheet
- 5. Ethernet Switch

## Sheet 7 of 16
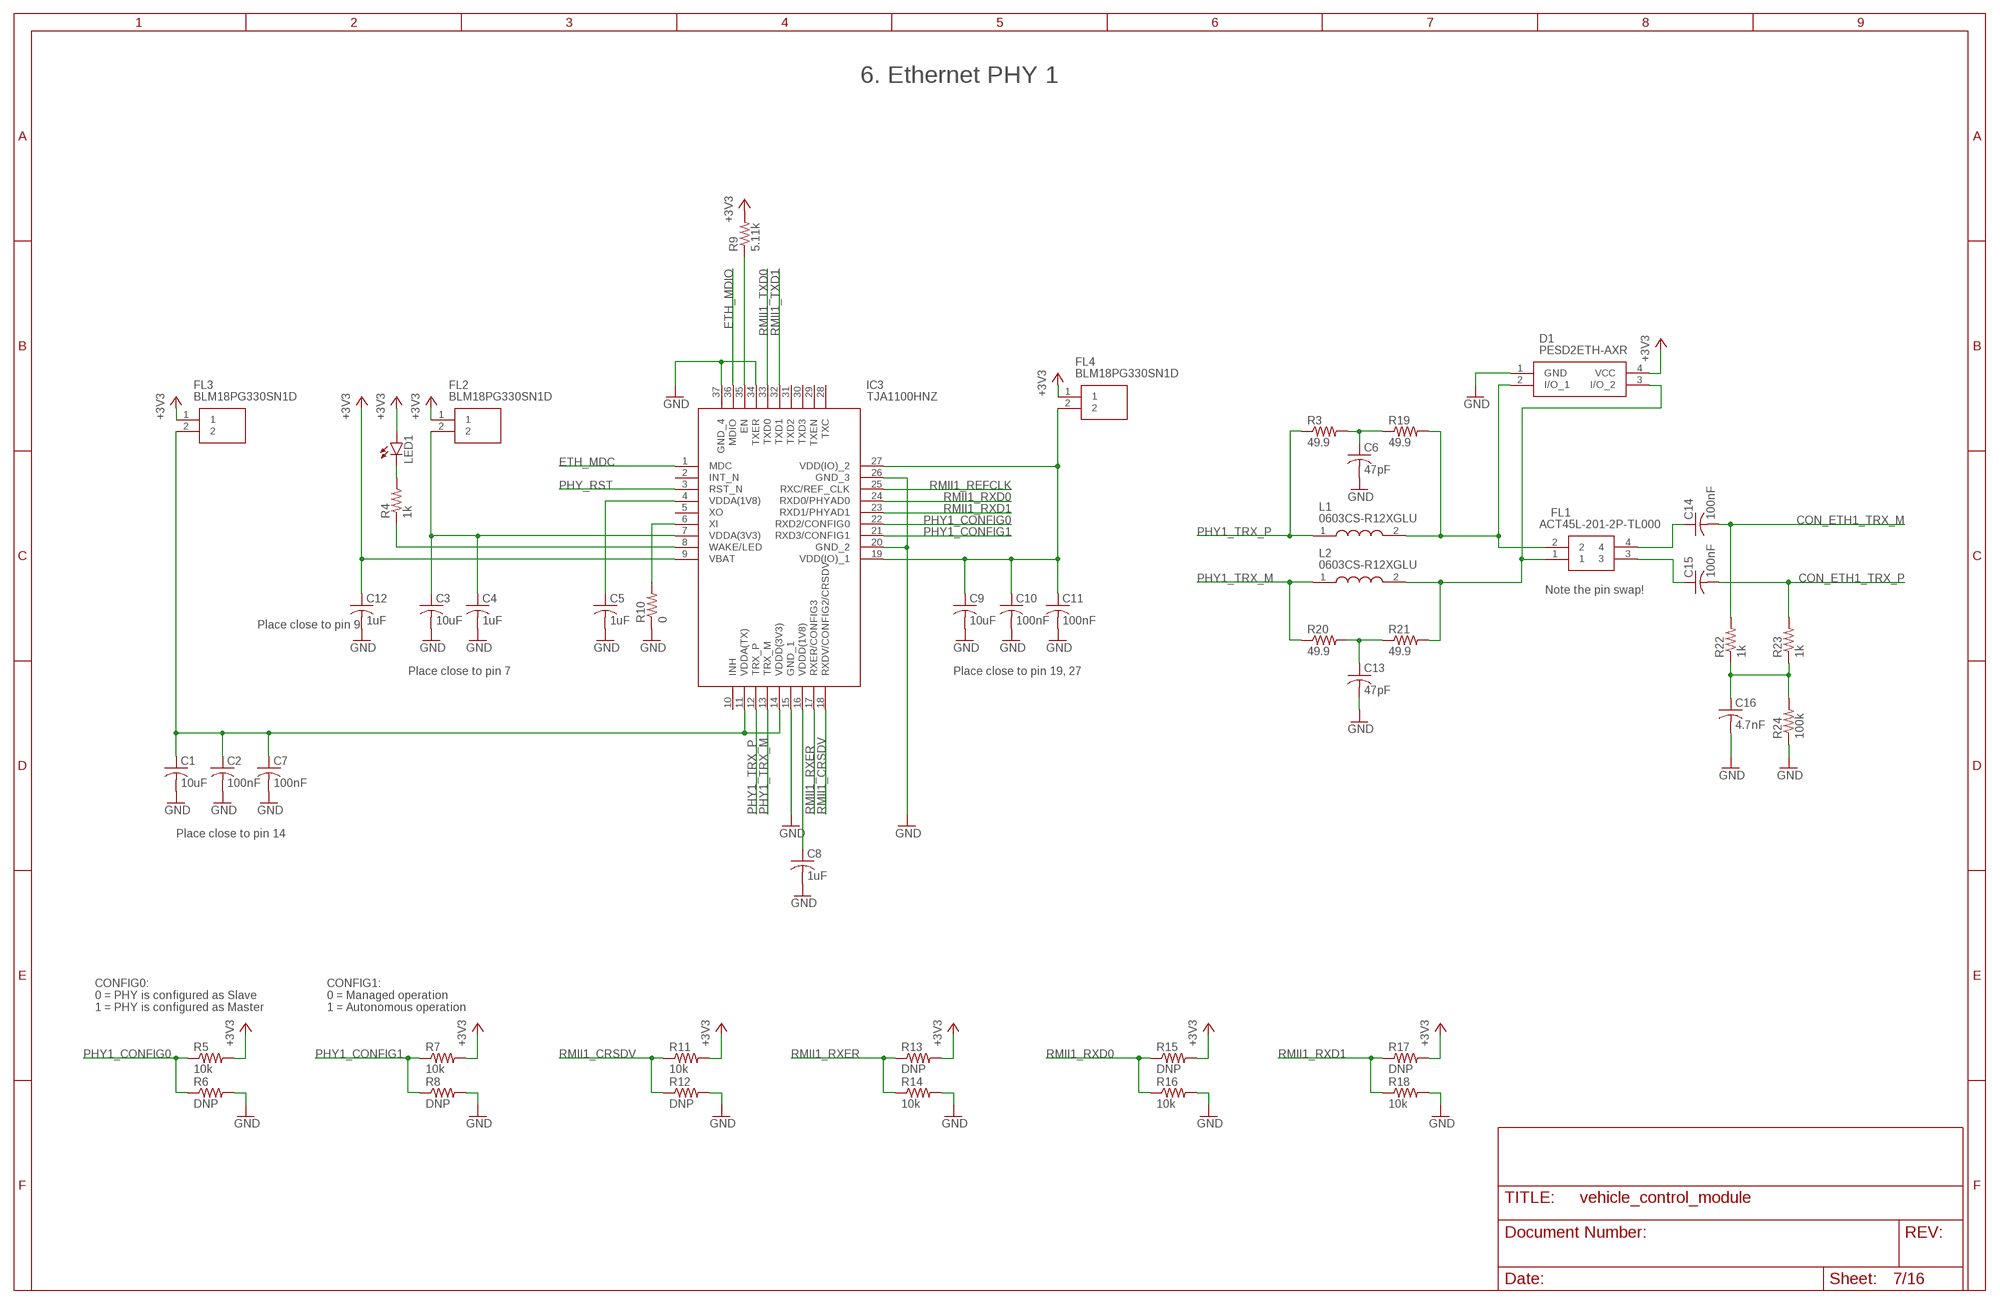
[diagram p6: schematic, sheet 7]

### Parts
C1  10uF  C-USC0603  [C0603]
C2  100nF  C-USC0603  [C0603]
C3  10uF  C-USC0603  [C0603]
C4  1uF  C-USC0603  [C0603]
C5  1uF  C-USC0603  [C0603]
C6  47pF  C-USC0603  [C0603]
C7  100nF  C-USC0603  [C0603]
C8  1uF  C-USC0603  [C0603]
C9  10uF  C-USC0603  [C0603]
C10  100nF  C-USC0603  [C0603]
C11  100nF  C-USC0603  [C0603]
C12  1uF  C-USC0603  [C0603]
C13  47pF  C-USC0603  [C0603]
C14  100nF  C-USC0603  [C0603]
C15  100nF  C-USC0603  [C0603]
C16  4.7nF  C-USC0603  [C0603]
D1  PESD2ETH-AXR  [PESD2ETHAXR]
FL1  ACT45L-201-2P-TL000  [ACT45L_1]
FL2  BLM18PG330SN1D  [BEADC1608X95N]
FL3  BLM18PG330SN1D  [BEADC1608X95N]
FL4  BLM18PG330SN1D  [BEADC1608X95N]
IC3  TJA1100HNZ  [QFN50P600X600X100-37N]
L1  0603CS-R12XGLU  [0603CS82NXGLW]
L2  0603CS-R12XGLU  [0603CS82NXGLW]
LED1  LEDCHIPLED_0603  [CHIPLED_0603]
R3  49.9  R-US_R0603  [R0603]
R4  1k  R-US_R0603  [R0603]
R5  10k  R-US_R0603  [R0603]
R6  DNP  R-US_R0603  [R0603]
R7  10k  R-US_R0603  [R0603]
R8  DNP  R-US_R0603  [R0603]
R9  5.11k  R-US_R0603  [R0603]
R10  0  R-US_R0603  [R0603]
R11  10k  R-US_R0603  [R0603]
R12  DNP  R-US_R0603  [R0603]
R13  DNP  R-US_R0603  [R0603]
R14  10k  R-US_R0603  [R0603]
R15  DNP  R-US_R0603  [R0603]
R16  10k  R-US_R0603  [R0603]
R17  DNP  R-US_R0603  [R0603]
R18  10k  R-US_R0603  [R0603]
R19  49.9  R-US_R0603  [R0603]
R20  49.9  R-US_R0603  [R0603]
R21  49.9  R-US_R0603  [R0603]
R22  1k  R-US_R0603  [R0603]
R23  1k  R-US_R0603  [R0603]
R24  100k  R-US_R0603  [R0603]

### Nets
+3V3: C12.1 D1.4(VCC) FL2.1 FL3.1 FL4.1 IC3.9(VBAT) LED1.A R5.2 R7.2 R9.2 R11.2 R13.2 R15.2 R17.2 ; also sheet 2,3,4,5,6,8,9,10,11,12,13,14,15
CON_ETH1_TRX_M: C14.2 R22.2
CON_ETH1_TRX_P: C15.2 R23.2
ETH_MDC: IC3.1(MDC) ; also sheet 3,8,9,10
ETH_MDIO: IC3.36(MDIO) ; also sheet 3,8,9,10
GND: C1.2 C2.2 C3.2 C4.2 C5.2 C6.2 C7.2 C8.2 C9.2 C10.2 C11.2 C12.2 C13.2 C16.2 D1.1(GND) IC3.15(GND_1) IC3.20(GND_2) IC3.26(GND_3) IC3.34(TXER) IC3.37(GND_4) R6.2 R8.2 R10.1 R12.2 R14.2 R16.2 R18.2 R24.1 ; also sheet 2,3,4,5,6,8,9,10,11,12,13,14,15,16
N$4: LED1.C R4.2
N$5: C5.1 IC3.4(VDDA(1V8))
N$6: IC3.8(WAKE/LED) R4.1
N$7: C8.1 IC3.16(VDDD(1V8))
N$8: C3.1 C4.1 FL2.2 IC3.7(VDDA(3V3))
N$9: C1.1 C2.1 C7.1 FL3.2 IC3.11(VDDA(TX)) IC3.14(VDDD(3V3))
N$10: C9.1 C10.1 C11.1 FL4.2 IC3.19(VDD(IO)_1) IC3.27(VDD(IO)_2)
N$11: IC3.35(EN) R9.1
N$12: IC3.6(XI) R10.2
N$13: D1.3(I/O_2) FL1.1 L2.2 R21.2
N$14: D1.2(I/O_1) FL1.2 L1.2 R19.2
N$15: C6.1 R3.2 R19.1
N$16: C13.1 R20.2 R21.1
N$17: C14.1 FL1.4
N$18: C15.1 FL1.3
N$19: C16.1 R22.1 R23.1 R24.2
PHY1_CONFIG0: IC3.22(RXD2/CONFIG0) R5.1 R6.1
PHY1_CONFIG1: IC3.21(RXD3/CONFIG1) R7.1 R8.1
PHY1_TRX_M: IC3.13(TRX_M) L2.1 R20.1
PHY1_TRX_P: IC3.12(TRX_P) L1.1 R3.1
PHY_RST: IC3.3(RST_N) ; also sheet 3,8,9
RMII1_CRSDV: IC3.18(RXDV/CONFIG2/CRSDV) R11.1 R12.1 ; also sheet 6
RMII1_REFCLK: IC3.25(RXC/REF_CLK) ; also sheet 6
RMII1_RXD0: IC3.24(RXD0/PHYAD0) R15.1 R16.1 ; also sheet 6
RMII1_RXD1: IC3.23(RXD1/PHYAD1) R17.1 R18.1 ; also sheet 6
RMII1_RXER: IC3.17(RXER/CONFIG3) R13.1 R14.1 ; also sheet 6
RMII1_TXD0: IC3.33(TXD0) ; also sheet 6
RMII1_TXD1: IC3.32(TXD1) ; also sheet 6
Unconnected: IC3.2(INT_N) IC3.5(XO) IC3.10(INH) IC3.28(TXC) IC3.29(TXEN) IC3.30(TXD3) IC3.31(TXD2)

### Notes on the sheet
- 6. Ethernet PHY 1
- Note the pin swap!
- Place close to pin 9
- Place close to pin 7 | Place close to pin 19, 27
- Place close to pin 14
- CONFIG0:
  0 = PHY is configured as Slave
  1 = PHY is configured as Master
- CONFIG1:
  0 = Managed operation
  1 = Autonomous operation

## Sheet 8 of 16
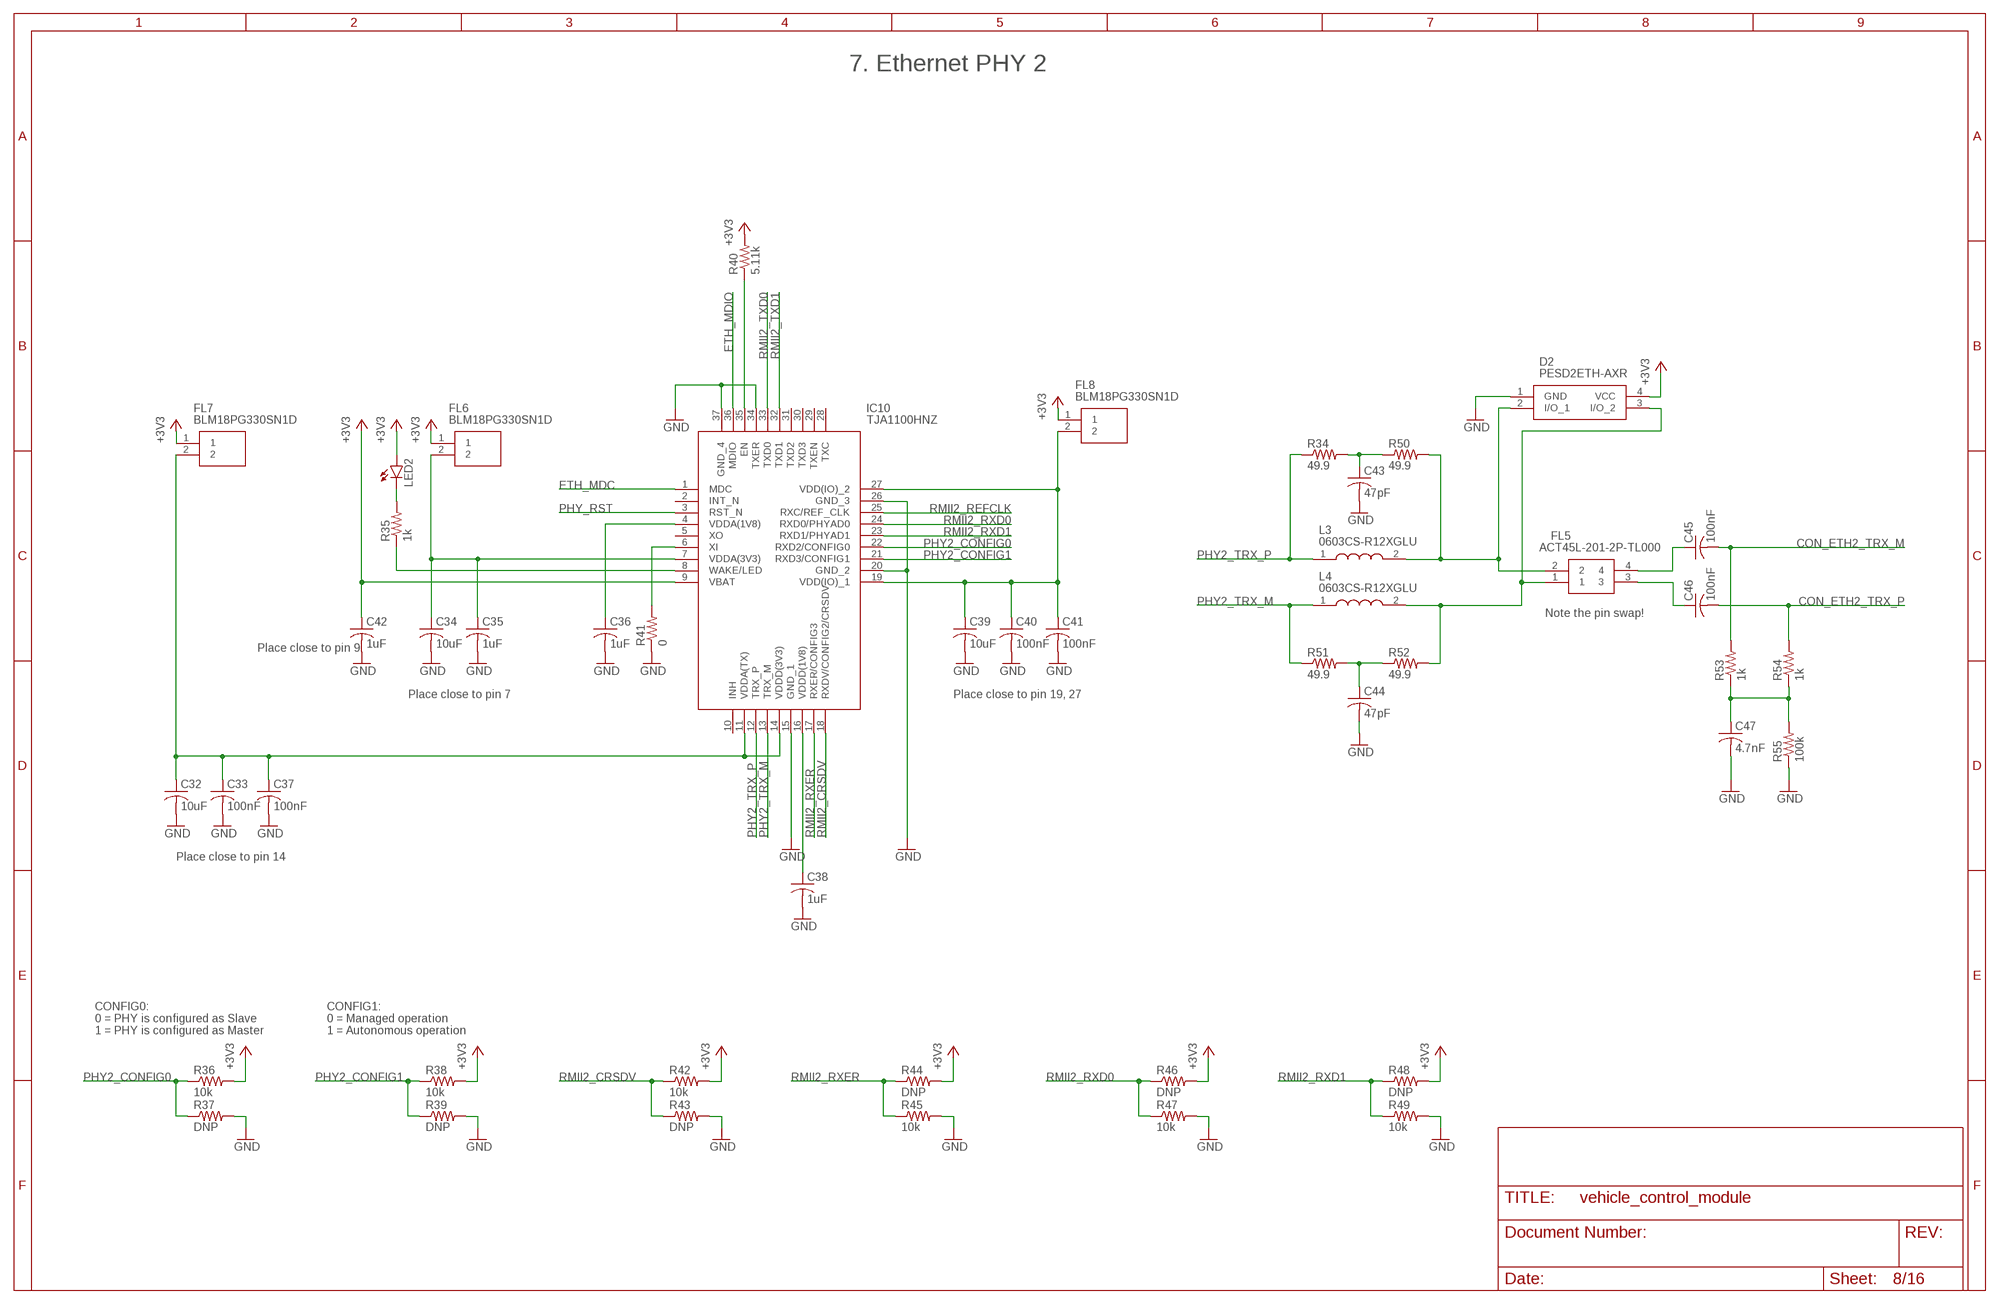
[diagram p7: schematic, sheet 8]

### Parts
C32  10uF  C-USC0603  [C0603]
C33  100nF  C-USC0603  [C0603]
C34  10uF  C-USC0603  [C0603]
C35  1uF  C-USC0603  [C0603]
C36  1uF  C-USC0603  [C0603]
C37  100nF  C-USC0603  [C0603]
C38  1uF  C-USC0603  [C0603]
C39  10uF  C-USC0603  [C0603]
C40  100nF  C-USC0603  [C0603]
C41  100nF  C-USC0603  [C0603]
C42  1uF  C-USC0603  [C0603]
C43  47pF  C-USC0603  [C0603]
C44  47pF  C-USC0603  [C0603]
C45  100nF  C-USC0603  [C0603]
C46  100nF  C-USC0603  [C0603]
C47  4.7nF  C-USC0603  [C0603]
D2  PESD2ETH-AXR  [PESD2ETHAXR]
FL5  ACT45L-201-2P-TL000  [ACT45L_1]
FL6  BLM18PG330SN1D  [BEADC1608X95N]
FL7  BLM18PG330SN1D  [BEADC1608X95N]
FL8  BLM18PG330SN1D  [BEADC1608X95N]
IC10  TJA1100HNZ  [QFN50P600X600X100-37N]
L3  0603CS-R12XGLU  [0603CS82NXGLW]
L4  0603CS-R12XGLU  [0603CS82NXGLW]
LED2  LEDCHIPLED_0603  [CHIPLED_0603]
R34  49.9  R-US_R0603  [R0603]
R35  1k  R-US_R0603  [R0603]
R36  10k  R-US_R0603  [R0603]
R37  DNP  R-US_R0603  [R0603]
R38  10k  R-US_R0603  [R0603]
R39  DNP  R-US_R0603  [R0603]
R40  5.11k  R-US_R0603  [R0603]
R41  0  R-US_R0603  [R0603]
R42  10k  R-US_R0603  [R0603]
R43  DNP  R-US_R0603  [R0603]
R44  DNP  R-US_R0603  [R0603]
R45  10k  R-US_R0603  [R0603]
R46  DNP  R-US_R0603  [R0603]
R47  10k  R-US_R0603  [R0603]
R48  DNP  R-US_R0603  [R0603]
R49  10k  R-US_R0603  [R0603]
R50  49.9  R-US_R0603  [R0603]
R51  49.9  R-US_R0603  [R0603]
R52  49.9  R-US_R0603  [R0603]
R53  1k  R-US_R0603  [R0603]
R54  1k  R-US_R0603  [R0603]
R55  100k  R-US_R0603  [R0603]

### Nets
+3V3: C42.1 D2.4(VCC) FL6.1 FL7.1 FL8.1 IC10.9(VBAT) LED2.A R36.2 R38.2 R40.2 R42.2 R44.2 R46.2 R48.2 ; also sheet 2,3,4,5,6,7,9,10,11,12,13,14,15
CON_ETH2_TRX_M: C45.2 R53.2
CON_ETH2_TRX_P: C46.2 R54.2
ETH_MDC: IC10.1(MDC) ; also sheet 3,7,9,10
ETH_MDIO: IC10.36(MDIO) ; also sheet 3,7,9,10
GND: C32.2 C33.2 C34.2 C35.2 C36.2 C37.2 C38.2 C39.2 C40.2 C41.2 C42.2 C43.2 C44.2 C47.2 D2.1(GND) IC10.15(GND_1) IC10.20(GND_2) IC10.26(GND_3) IC10.34(TXER) IC10.37(GND_4) R37.2 R39.2 R41.1 R43.2 R45.2 R47.2 R49.2 R55.1 ; also sheet 2,3,4,5,6,7,9,10,11,12,13,14,15,16
N$29: LED2.C R35.2
N$31: IC10.8(WAKE/LED) R35.1
N$32: C36.1 IC10.4(VDDA(1V8))
N$33: C38.1 IC10.16(VDDD(1V8))
N$34: C34.1 C35.1 FL6.2 IC10.7(VDDA(3V3))
N$35: C32.1 C33.1 C37.1 FL7.2 IC10.11(VDDA(TX)) IC10.14(VDDD(3V3))
N$36: C39.1 C40.1 C41.1 FL8.2 IC10.19(VDD(IO)_1) IC10.27(VDD(IO)_2)
N$37: IC10.35(EN) R40.1
N$42: IC10.6(XI) R41.2
N$44: D2.3(I/O_2) FL5.1 L4.2 R52.2
N$45: D2.2(I/O_1) FL5.2 L3.2 R50.2
N$46: C43.1 R34.2 R50.1
N$47: C44.1 R51.2 R52.1
N$48: C45.1 FL5.4
N$49: C46.1 FL5.3
N$50: C47.1 R53.1 R54.1 R55.2
PHY2_CONFIG0: IC10.22(RXD2/CONFIG0) R36.1 R37.1
PHY2_CONFIG1: IC10.21(RXD3/CONFIG1) R38.1 R39.1
PHY2_TRX_M: IC10.13(TRX_M) L4.1 R51.1
PHY2_TRX_P: IC10.12(TRX_P) L3.1 R34.1
PHY_RST: IC10.3(RST_N) ; also sheet 3,7,9
RMII2_CRSDV: IC10.18(RXDV/CONFIG2/CRSDV) R42.1 R43.1 ; also sheet 6
RMII2_REFCLK: IC10.25(RXC/REF_CLK) ; also sheet 6
RMII2_RXD0: IC10.24(RXD0/PHYAD0) R46.1 R47.1 ; also sheet 6
RMII2_RXD1: IC10.23(RXD1/PHYAD1) R48.1 R49.1 ; also sheet 6
RMII2_RXER: IC10.17(RXER/CONFIG3) R44.1 R45.1
RMII2_TXD0: IC10.33(TXD0) ; also sheet 6
RMII2_TXD1: IC10.32(TXD1) ; also sheet 6
Unconnected: IC10.2(INT_N) IC10.5(XO) IC10.10(INH) IC10.28(TXC) IC10.29(TXEN) IC10.30(TXD3) IC10.31(TXD2)

### Notes on the sheet
- 7. Ethernet PHY 2
- Note the pin swap!
- Place close to pin 9
- Place close to pin 7 | Place close to pin 19, 27
- Place close to pin 14
- CONFIG0:
  0 = PHY is configured as Slave
  1 = PHY is configured as Master
- CONFIG1:
  0 = Managed operation
  1 = Autonomous operation

## Sheet 9 of 16
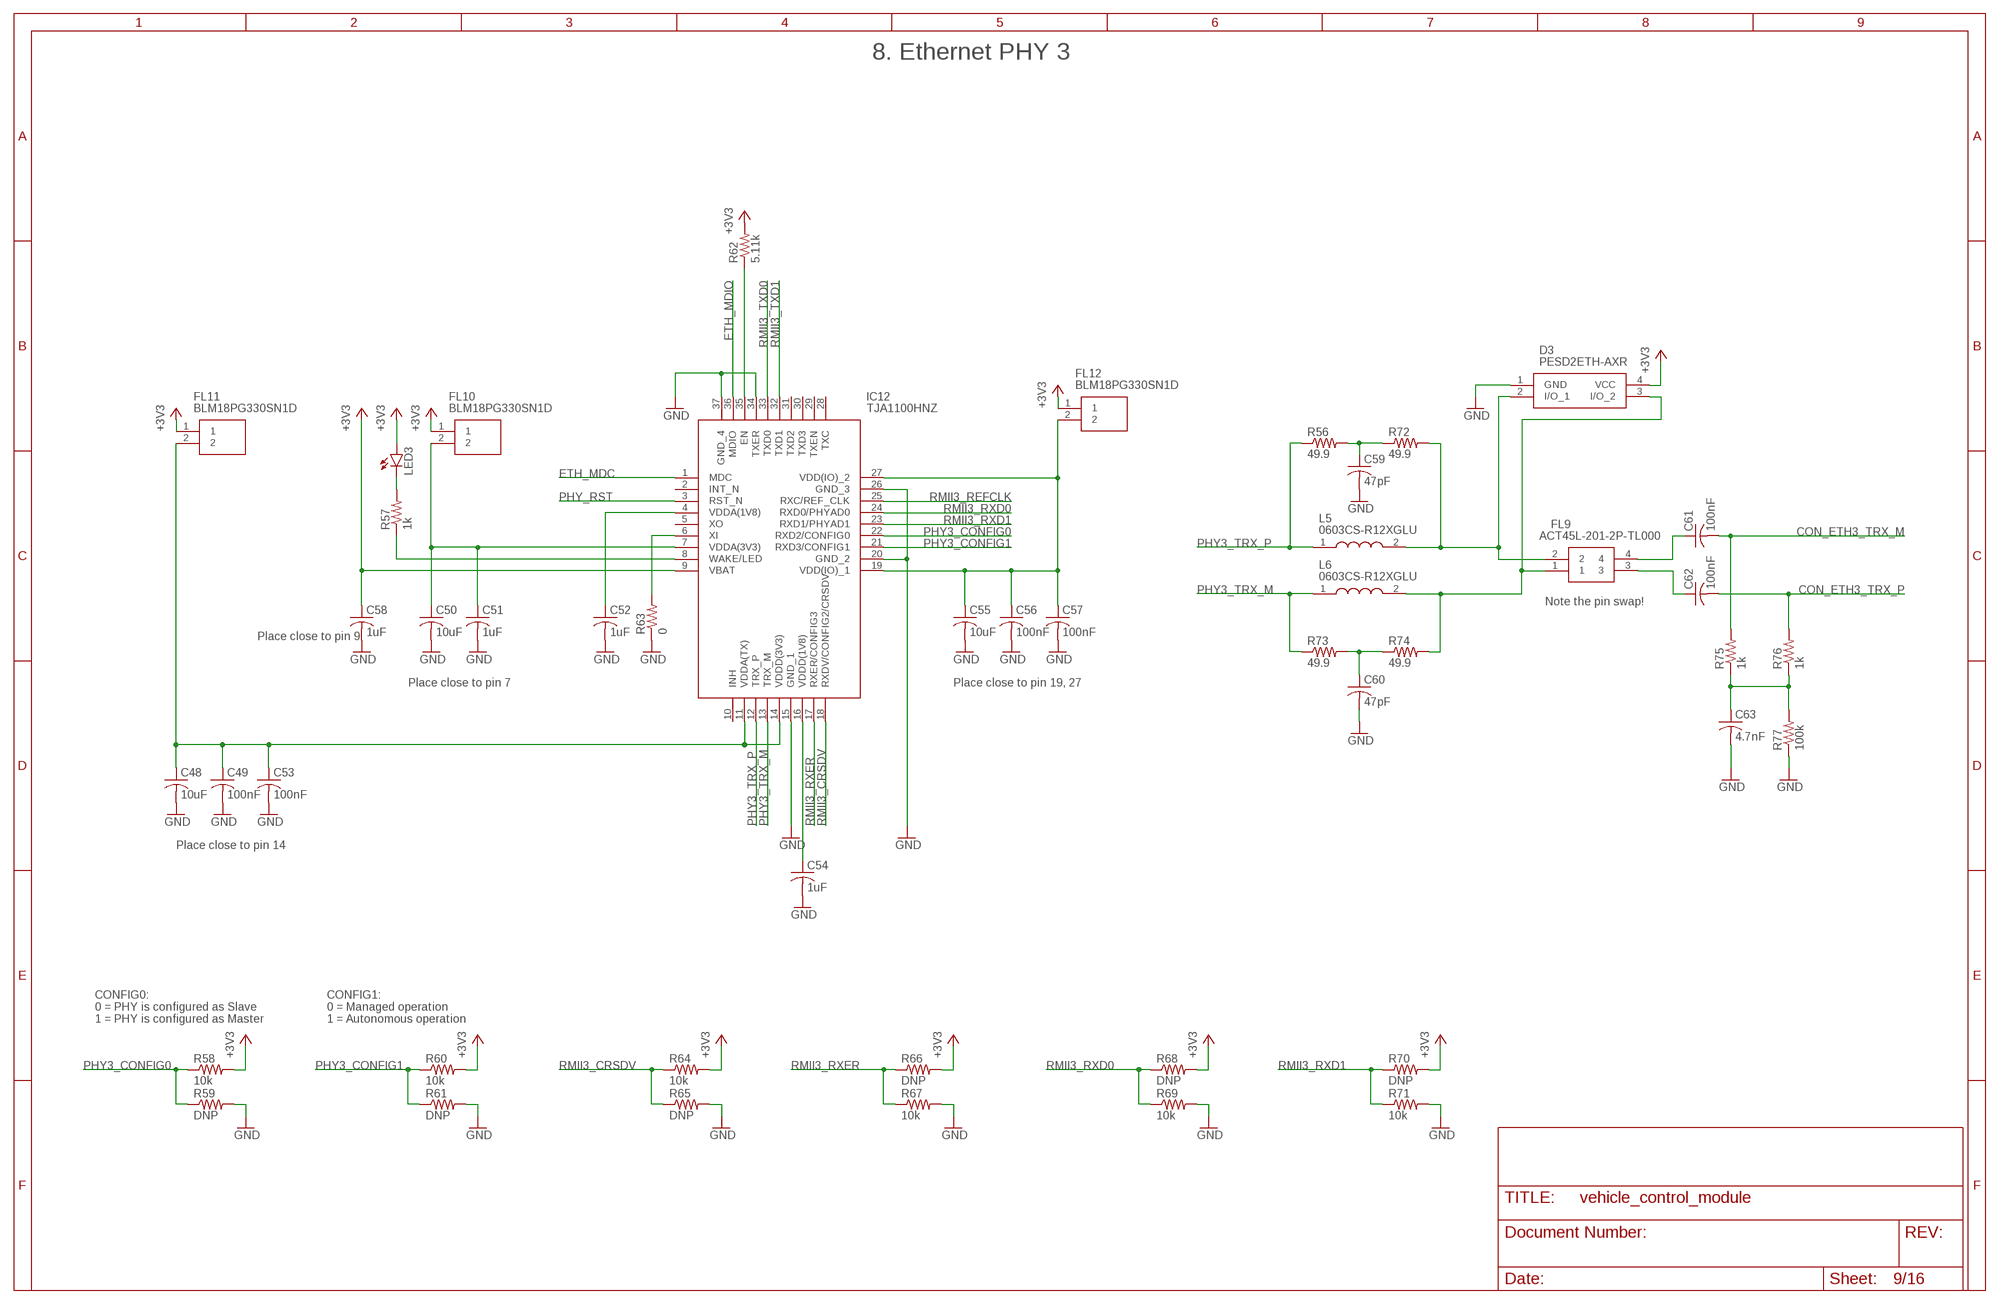
[diagram p8: schematic, sheet 9]

### Parts
C48  10uF  C-USC0603  [C0603]
C49  100nF  C-USC0603  [C0603]
C50  10uF  C-USC0603  [C0603]
C51  1uF  C-USC0603  [C0603]
C52  1uF  C-USC0603  [C0603]
C53  100nF  C-USC0603  [C0603]
C54  1uF  C-USC0603  [C0603]
C55  10uF  C-USC0603  [C0603]
C56  100nF  C-USC0603  [C0603]
C57  100nF  C-USC0603  [C0603]
C58  1uF  C-USC0603  [C0603]
C59  47pF  C-USC0603  [C0603]
C60  47pF  C-USC0603  [C0603]
C61  100nF  C-USC0603  [C0603]
C62  100nF  C-USC0603  [C0603]
C63  4.7nF  C-USC0603  [C0603]
D3  PESD2ETH-AXR  [PESD2ETHAXR]
FL9  ACT45L-201-2P-TL000  [ACT45L_1]
FL10  BLM18PG330SN1D  [BEADC1608X95N]
FL11  BLM18PG330SN1D  [BEADC1608X95N]
FL12  BLM18PG330SN1D  [BEADC1608X95N]
IC12  TJA1100HNZ  [QFN50P600X600X100-37N]
L5  0603CS-R12XGLU  [0603CS82NXGLW]
L6  0603CS-R12XGLU  [0603CS82NXGLW]
LED3  LEDCHIPLED_0603  [CHIPLED_0603]
R56  49.9  R-US_R0603  [R0603]
R57  1k  R-US_R0603  [R0603]
R58  10k  R-US_R0603  [R0603]
R59  DNP  R-US_R0603  [R0603]
R60  10k  R-US_R0603  [R0603]
R61  DNP  R-US_R0603  [R0603]
R62  5.11k  R-US_R0603  [R0603]
R63  0  R-US_R0603  [R0603]
R64  10k  R-US_R0603  [R0603]
R65  DNP  R-US_R0603  [R0603]
R66  DNP  R-US_R0603  [R0603]
R67  10k  R-US_R0603  [R0603]
R68  DNP  R-US_R0603  [R0603]
R69  10k  R-US_R0603  [R0603]
R70  DNP  R-US_R0603  [R0603]
R71  10k  R-US_R0603  [R0603]
R72  49.9  R-US_R0603  [R0603]
R73  49.9  R-US_R0603  [R0603]
R74  49.9  R-US_R0603  [R0603]
R75  1k  R-US_R0603  [R0603]
R76  1k  R-US_R0603  [R0603]
R77  100k  R-US_R0603  [R0603]

### Nets
+3V3: C58.1 D3.4(VCC) FL10.1 FL11.1 FL12.1 IC12.9(VBAT) LED3.A R58.2 R60.2 R62.2 R64.2 R66.2 R68.2 R70.2 ; also sheet 2,3,4,5,6,7,8,10,11,12,13,14,15
CON_ETH3_TRX_M: C61.2 R75.2
CON_ETH3_TRX_P: C62.2 R76.2
ETH_MDC: IC12.1(MDC) ; also sheet 3,7,8,10
ETH_MDIO: IC12.36(MDIO) ; also sheet 3,7,8,10
GND: C48.2 C49.2 C50.2 C51.2 C52.2 C53.2 C54.2 C55.2 C56.2 C57.2 C58.2 C59.2 C60.2 C63.2 D3.1(GND) IC12.15(GND_1) IC12.20(GND_2) IC12.26(GND_3) IC12.34(TXER) IC12.37(GND_4) R59.2 R61.2 R63.1 R65.2 R67.2 R69.2 R71.2 R77.1 ; also sheet 2,3,4,5,6,7,8,10,11,12,13,14,15,16
N$51: LED3.C R57.2
N$52: IC12.8(WAKE/LED) R57.1
N$53: C52.1 IC12.4(VDDA(1V8))
N$54: C54.1 IC12.16(VDDD(1V8))
N$55: C50.1 C51.1 FL10.2 IC12.7(VDDA(3V3))
N$56: C48.1 C49.1 C53.1 FL11.2 IC12.11(VDDA(TX)) IC12.14(VDDD(3V3))
N$57: C55.1 C56.1 C57.1 FL12.2 IC12.19(VDD(IO)_1) IC12.27(VDD(IO)_2)
N$58: IC12.35(EN) R62.1
N$59: IC12.6(XI) R63.2
N$60: D3.3(I/O_2) FL9.1 L6.2 R74.2
N$61: D3.2(I/O_1) FL9.2 L5.2 R72.2
N$62: C59.1 R56.2 R72.1
N$63: C60.1 R73.2 R74.1
N$64: C61.1 FL9.4
N$65: C62.1 FL9.3
N$66: C63.1 R75.1 R76.1 R77.2
PHY3_CONFIG0: IC12.22(RXD2/CONFIG0) R58.1 R59.1
PHY3_CONFIG1: IC12.21(RXD3/CONFIG1) R60.1 R61.1
PHY3_TRX_M: IC12.13(TRX_M) L6.1 R73.1
PHY3_TRX_P: IC12.12(TRX_P) L5.1 R56.1
PHY_RST: IC12.3(RST_N) ; also sheet 3,7,8
RMII3_CRSDV: IC12.18(RXDV/CONFIG2/CRSDV) R64.1 R65.1 ; also sheet 6
RMII3_REFCLK: IC12.25(RXC/REF_CLK) ; also sheet 6
RMII3_RXD0: IC12.24(RXD0/PHYAD0) R68.1 R69.1 ; also sheet 6
RMII3_RXD1: IC12.23(RXD1/PHYAD1) R70.1 R71.1 ; also sheet 6
RMII3_RXER: IC12.17(RXER/CONFIG3) R66.1 R67.1
RMII3_TXD0: IC12.33(TXD0) ; also sheet 6
RMII3_TXD1: IC12.32(TXD1) ; also sheet 6
Unconnected: IC12.2(INT_N) IC12.5(XO) IC12.10(INH) IC12.28(TXC) IC12.29(TXEN) IC12.30(TXD3) IC12.31(TXD2)

### Notes on the sheet
- 8. Ethernet PHY 3
- Note the pin swap!
- Place close to pin 9
- Place close to pin 7 | Place close to pin 19, 27
- Place close to pin 14
- CONFIG0:
  0 = PHY is configured as Slave
  1 = PHY is configured as Master
- CONFIG1:
  0 = Managed operation
  1 = Autonomous operation

## Sheet 10 of 16
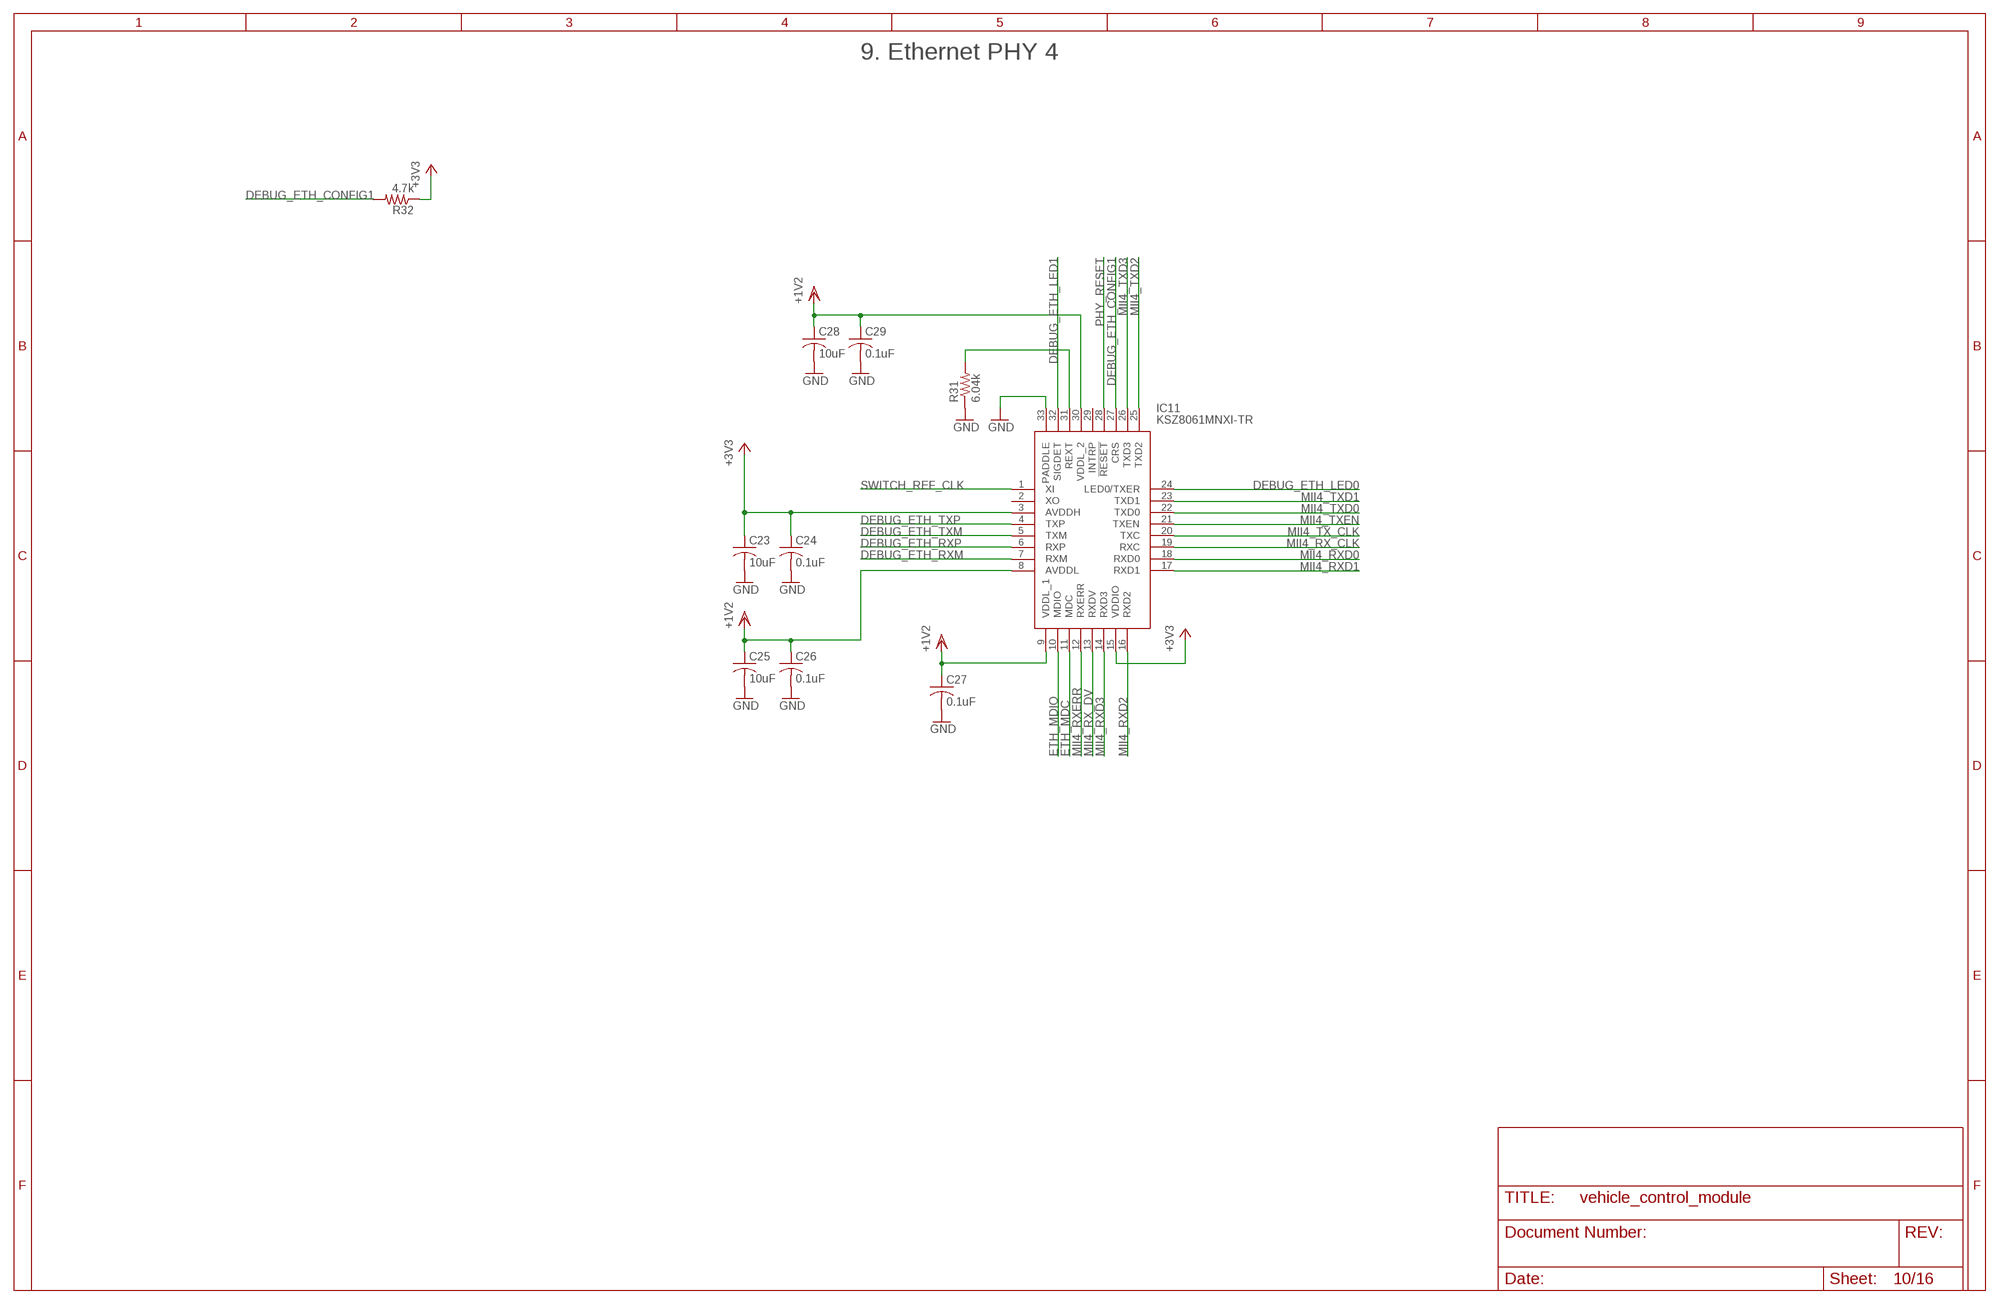
[diagram p9: schematic, sheet 10]

### Parts
C23  10uF  C-USC0603  [C0603]
C24  0.1uF  C-USC0603  [C0603]
C25  10uF  C-USC0603  [C0603]
C26  0.1uF  C-USC0603  [C0603]
C27  0.1uF  C-USC0603  [C0603]
C28  10uF  C-USC0603  [C0603]
C29  0.1uF  C-USC0603  [C0603]
IC11  KSZ8061MNXI-TR  [QFN50P500X500X85-33N]
R31  6.04k  R-US_R0603  [R0603]
R32  4.7k  R-US_R0603  [R0603]

### Nets
+3V3: C23.1 C24.1 IC11.3(AVDDH) IC11.15(VDDIO) R32.1 ; also sheet 2,3,4,5,6,7,8,9,11,12,13,14,15
DEBUG_ETH_CONFIG1: IC11.27(CRS) R32.2
DEBUG_ETH_LED0: IC11.24(LED0/TXER) ; also sheet 16
DEBUG_ETH_LED1: IC11.32(SIGDET) ; also sheet 16
DEBUG_ETH_RXM: IC11.7(RXM) ; also sheet 16
DEBUG_ETH_RXP: IC11.6(RXP) ; also sheet 16
DEBUG_ETH_TXM: IC11.5(TXM) ; also sheet 16
DEBUG_ETH_TXP: IC11.4(TXP) ; also sheet 16
ETH_MDC: IC11.11(MDC) ; also sheet 3,7,8,9
ETH_MDIO: IC11.10(MDIO) ; also sheet 3,7,8,9
GND: C23.2 C24.2 C25.2 C26.2 C27.2 C28.2 C29.2 IC11.33(PADDLE) R31.1 ; also sheet 2,3,4,5,6,7,8,9,11,12,13,14,15,16
MII4_RX_CLK: IC11.19(RXC) ; also sheet 6
MII4_RX_DV: IC11.13(RXDV) ; also sheet 6
MII4_RXD0: IC11.18(RXD0) ; also sheet 6
MII4_RXD1: IC11.17(RXD1) ; also sheet 6
MII4_RXD2: IC11.16(RXD2) ; also sheet 6
MII4_RXD3: IC11.14(RXD3) ; also sheet 6
MII4_RXERR: IC11.12(RXERR)
MII4_TX_CLK: IC11.20(TXC) ; also sheet 6
MII4_TXD0: IC11.22(TXD0) ; also sheet 6
MII4_TXD1: IC11.23(TXD1) ; also sheet 6
MII4_TXD2: IC11.25(TXD2) ; also sheet 6
MII4_TXD3: IC11.26(TXD3) ; also sheet 6
MII4_TXEN: IC11.21(TXEN) ; also sheet 6
N$30: IC11.31(REXT) R31.2
PHY_RESET: IC11.28(!RESET)
SWITCH_REF_CLK: IC11.1(XI) ; also sheet 6
VDD: C25.1 C26.1 C27.1 C28.1 C29.1 IC11.8(AVDDL) IC11.9(VDDL_1) IC11.30(VDDL_2) ; supply symbol labelled +1V2 ; also sheet 2,6
Unconnected: IC11.2(XO) IC11.29(INTRP)

### Notes on the sheet
- 9. Ethernet PHY 4

## Sheet 11 of 16
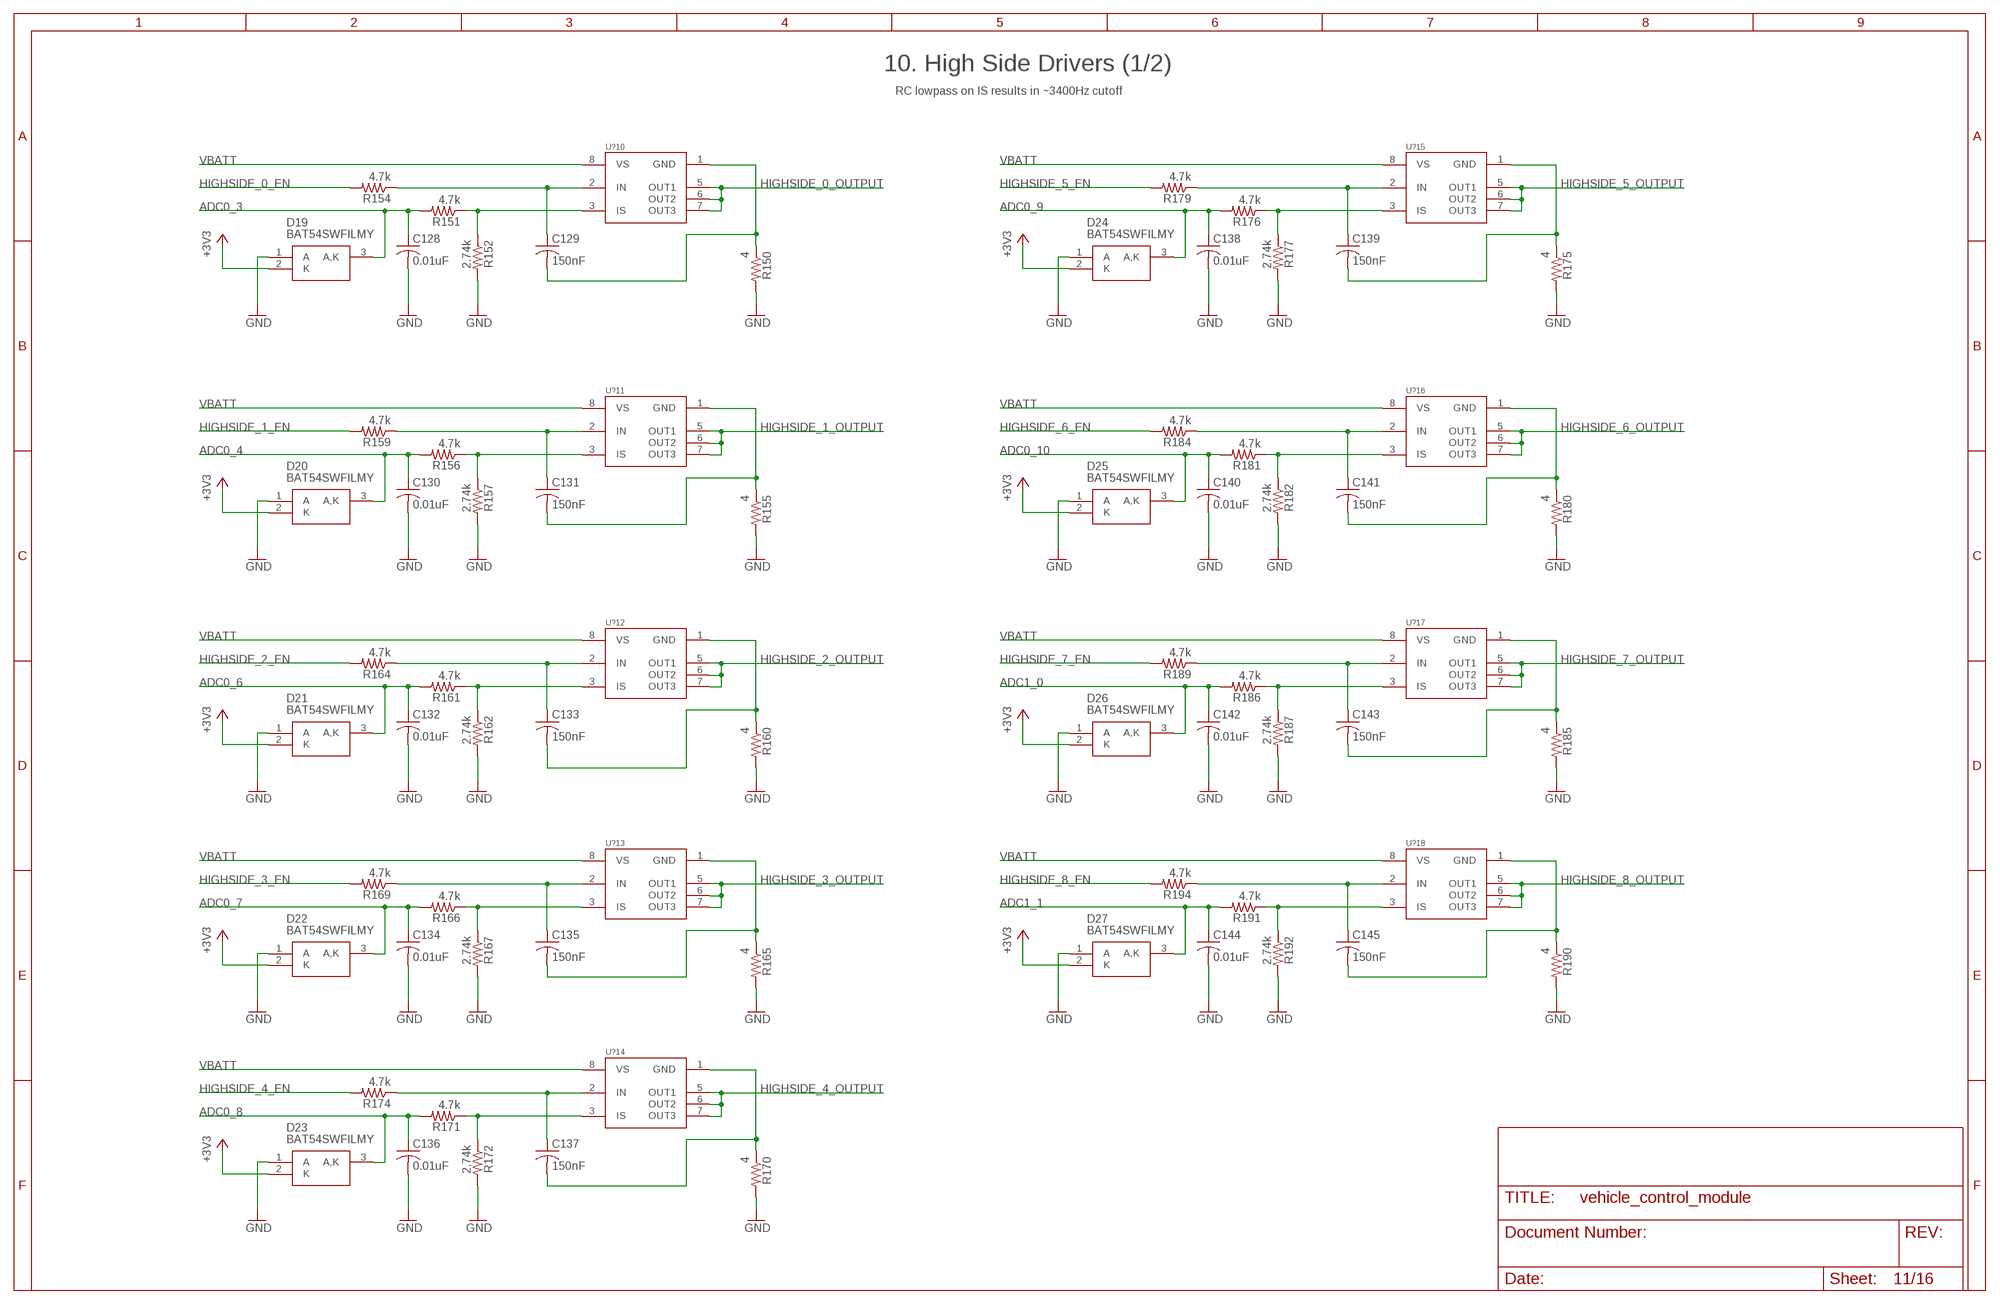
[diagram p10: schematic, sheet 11]

### Parts
C128  0.01uF  C-USC0603  [C0603]
C129  150nF  C-USC0603  [C0603]
C130  0.01uF  C-USC0603  [C0603]
C131  150nF  C-USC0603  [C0603]
C132  0.01uF  C-USC0603  [C0603]
C133  150nF  C-USC0603  [C0603]
C134  0.01uF  C-USC0603  [C0603]
C135  150nF  C-USC0603  [C0603]
C136  0.01uF  C-USC0603  [C0603]
C137  150nF  C-USC0603  [C0603]
C138  0.01uF  C-USC0603  [C0603]
C139  150nF  C-USC0603  [C0603]
C140  0.01uF  C-USC0603  [C0603]
C141  150nF  C-USC0603  [C0603]
C142  0.01uF  C-USC0603  [C0603]
C143  150nF  C-USC0603  [C0603]
C144  0.01uF  C-USC0603  [C0603]
C145  150nF  C-USC0603  [C0603]
D19  BAT54SWFILMY  [SOT65P210X110-3N]
D20  BAT54SWFILMY  [SOT65P210X110-3N]
D21  BAT54SWFILMY  [SOT65P210X110-3N]
D22  BAT54SWFILMY  [SOT65P210X110-3N]
D23  BAT54SWFILMY  [SOT65P210X110-3N]
D24  BAT54SWFILMY  [SOT65P210X110-3N]
D25  BAT54SWFILMY  [SOT65P210X110-3N]
D26  BAT54SWFILMY  [SOT65P210X110-3N]
D27  BAT54SWFILMY  [SOT65P210X110-3N]
R150  4  R-US_R1206  [R1206]
R151  4.7k  R-US_R0603  [R0603]
R152  2.74k  R-US_R0603  [R0603]
R154  4.7k  R-US_R0603  [R0603]
R155  4  R-US_R1206  [R1206]
R156  4.7k  R-US_R0603  [R0603]
R157  2.74k  R-US_R0603  [R0603]
R159  4.7k  R-US_R0603  [R0603]
R160  4  R-US_R1206  [R1206]
R161  4.7k  R-US_R0603  [R0603]
R162  2.74k  R-US_R0603  [R0603]
R164  4.7k  R-US_R0603  [R0603]
R165  4  R-US_R1206  [R1206]
R166  4.7k  R-US_R0603  [R0603]
R167  2.74k  R-US_R0603  [R0603]
R169  4.7k  R-US_R0603  [R0603]
R170  4  R-US_R1206  [R1206]
R171  4.7k  R-US_R0603  [R0603]
R172  2.74k  R-US_R0603  [R0603]
R174  4.7k  R-US_R0603  [R0603]
R175  4  R-US_R1206  [R1206]
R176  4.7k  R-US_R0603  [R0603]
R177  2.74k  R-US_R0603  [R0603]
R179  4.7k  R-US_R0603  [R0603]
R180  4  R-US_R1206  [R1206]
R181  4.7k  R-US_R0603  [R0603]
R182  2.74k  R-US_R0603  [R0603]
R184  4.7k  R-US_R0603  [R0603]
R185  4  R-US_R1206  [R1206]
R186  4.7k  R-US_R0603  [R0603]
R187  2.74k  R-US_R0603  [R0603]
R189  4.7k  R-US_R0603  [R0603]
R190  4  R-US_R1206  [R1206]
R191  4.7k  R-US_R0603  [R0603]
R192  2.74k  R-US_R0603  [R0603]
R194  4.7k  R-US_R0603  [R0603]
U?10  BTS50015-1TAD  [TO127P1500X450-7_8N-V1]
U?11  BTS50015-1TAD  [TO127P1500X450-7_8N-V1]
U?12  BTS50015-1TAD  [TO127P1500X450-7_8N-V1]
U?13  BTS50015-1TAD  [TO127P1500X450-7_8N-V1]
U?14  BTS50015-1TAD  [TO127P1500X450-7_8N-V1]
U?15  BTS50015-1TAD  [TO127P1500X450-7_8N-V1]
U?16  BTS50015-1TAD  [TO127P1500X450-7_8N-V1]
U?17  BTS50015-1TAD  [TO127P1500X450-7_8N-V1]
U?18  BTS50015-1TAD  [TO127P1500X450-7_8N-V1]

### Nets
+3V3: D19.2(K) D20.2(K) D21.2(K) D22.2(K) D23.2(K) D24.2(K) D25.2(K) D26.2(K) D27.2(K) ; also sheet 2,3,4,5,6,7,8,9,10,12,13,14,15
ADC0_3: C128.1 D19.3(A,K) R151.2 ; also sheet 3
ADC0_4: C130.1 D20.3(A,K) R156.2 ; also sheet 3
ADC0_6: C132.1 D21.3(A,K) R161.2 ; also sheet 3
ADC0_7: C134.1 D22.3(A,K) R166.2 ; also sheet 3
ADC0_8: C136.1 D23.3(A,K) R171.2 ; also sheet 3
ADC0_9: C138.1 D24.3(A,K) R176.2 ; also sheet 3
ADC0_10: C140.1 D25.3(A,K) R181.2 ; also sheet 3
ADC1_0: C142.1 D26.3(A,K) R186.2 ; also sheet 3
ADC1_1: C144.1 D27.3(A,K) R191.2 ; also sheet 3
GND: C128.2 C130.2 C132.2 C134.2 C136.2 C138.2 C140.2 C142.2 C144.2 D19.1(A) D20.1(A) D21.1(A) D22.1(A) D23.1(A) D24.1(A) D25.1(A) D26.1(A) D27.1(A) R150.2 R152.2 R155.2 R157.2 R160.2 R162.2 R165.2 R167.2 R170.2 R172.2 R175.2 R177.2 R180.2 R182.2 R185.2 R187.2 R190.2 R192.2 ; also sheet 2,3,4,5,6,7,8,9,10,12,13,14,15,16
HIGHSIDE_0_EN: R154.2 ; also sheet 3
HIGHSIDE_0_OUTPUT: U?10.5(OUT1) U?10.6(OUT2) U?10.7(OUT3)
HIGHSIDE_1_EN: R159.2 ; also sheet 3
HIGHSIDE_1_OUTPUT: U?11.5(OUT1) U?11.6(OUT2) U?11.7(OUT3)
HIGHSIDE_2_EN: R164.2 ; also sheet 3
HIGHSIDE_2_OUTPUT: U?12.5(OUT1) U?12.6(OUT2) U?12.7(OUT3)
HIGHSIDE_3_EN: R169.2 ; also sheet 3
HIGHSIDE_3_OUTPUT: U?13.5(OUT1) U?13.6(OUT2) U?13.7(OUT3)
HIGHSIDE_4_EN: R174.2 ; also sheet 3
HIGHSIDE_4_OUTPUT: U?14.5(OUT1) U?14.6(OUT2) U?14.7(OUT3)
HIGHSIDE_5_EN: R179.2 ; also sheet 3
HIGHSIDE_5_OUTPUT: U?15.5(OUT1) U?15.6(OUT2) U?15.7(OUT3)
HIGHSIDE_6_EN: R184.2 ; also sheet 3
HIGHSIDE_6_OUTPUT: U?16.5(OUT1) U?16.6(OUT2) U?16.7(OUT3)
HIGHSIDE_7_EN: R189.2 ; also sheet 3
HIGHSIDE_7_OUTPUT: U?17.5(OUT1) U?17.6(OUT2) U?17.7(OUT3)
HIGHSIDE_8_EN: R194.2 ; also sheet 3
HIGHSIDE_8_OUTPUT: U?18.5(OUT1) U?18.6(OUT2) U?18.7(OUT3)
N$121: C129.2 R150.1 U?10.1(GND)
N$122: R151.1 R152.1 U?10.3(IS)
N$123: C129.1 R154.1 U?10.2(IN)
N$124: C131.2 R155.1 U?11.1(GND)
N$125: R156.1 R157.1 U?11.3(IS)
N$126: C131.1 R159.1 U?11.2(IN)
N$127: C133.2 R160.1 U?12.1(GND)
N$128: R161.1 R162.1 U?12.3(IS)
N$129: C133.1 R164.1 U?12.2(IN)
N$130: C135.2 R165.1 U?13.1(GND)
N$131: R166.1 R167.1 U?13.3(IS)
N$132: C135.1 R169.1 U?13.2(IN)
N$133: C137.2 R170.1 U?14.1(GND)
N$134: R171.1 R172.1 U?14.3(IS)
N$135: C137.1 R174.1 U?14.2(IN)
N$136: C139.2 R175.1 U?15.1(GND)
N$137: R176.1 R177.1 U?15.3(IS)
N$138: C139.1 R179.1 U?15.2(IN)
N$139: C141.2 R180.1 U?16.1(GND)
N$140: R181.1 R182.1 U?16.3(IS)
N$141: C141.1 R184.1 U?16.2(IN)
N$142: C143.2 R185.1 U?17.1(GND)
N$143: R186.1 R187.1 U?17.3(IS)
N$144: C143.1 R189.1 U?17.2(IN)
N$145: C145.2 R190.1 U?18.1(GND)
N$146: R191.1 R192.1 U?18.3(IS)
N$147: C145.1 R194.1 U?18.2(IN)
VBATT: U?10.8(VS) U?11.8(VS) U?12.8(VS) U?13.8(VS) U?14.8(VS) U?15.8(VS) U?16.8(VS) U?17.8(VS) U?18.8(VS) ; also sheet 2,12

### Notes on the sheet
- 10. High Side Drivers (1/2)
- RC lowpass on IS results in ~3400Hz cutoff

## Sheet 12 of 16
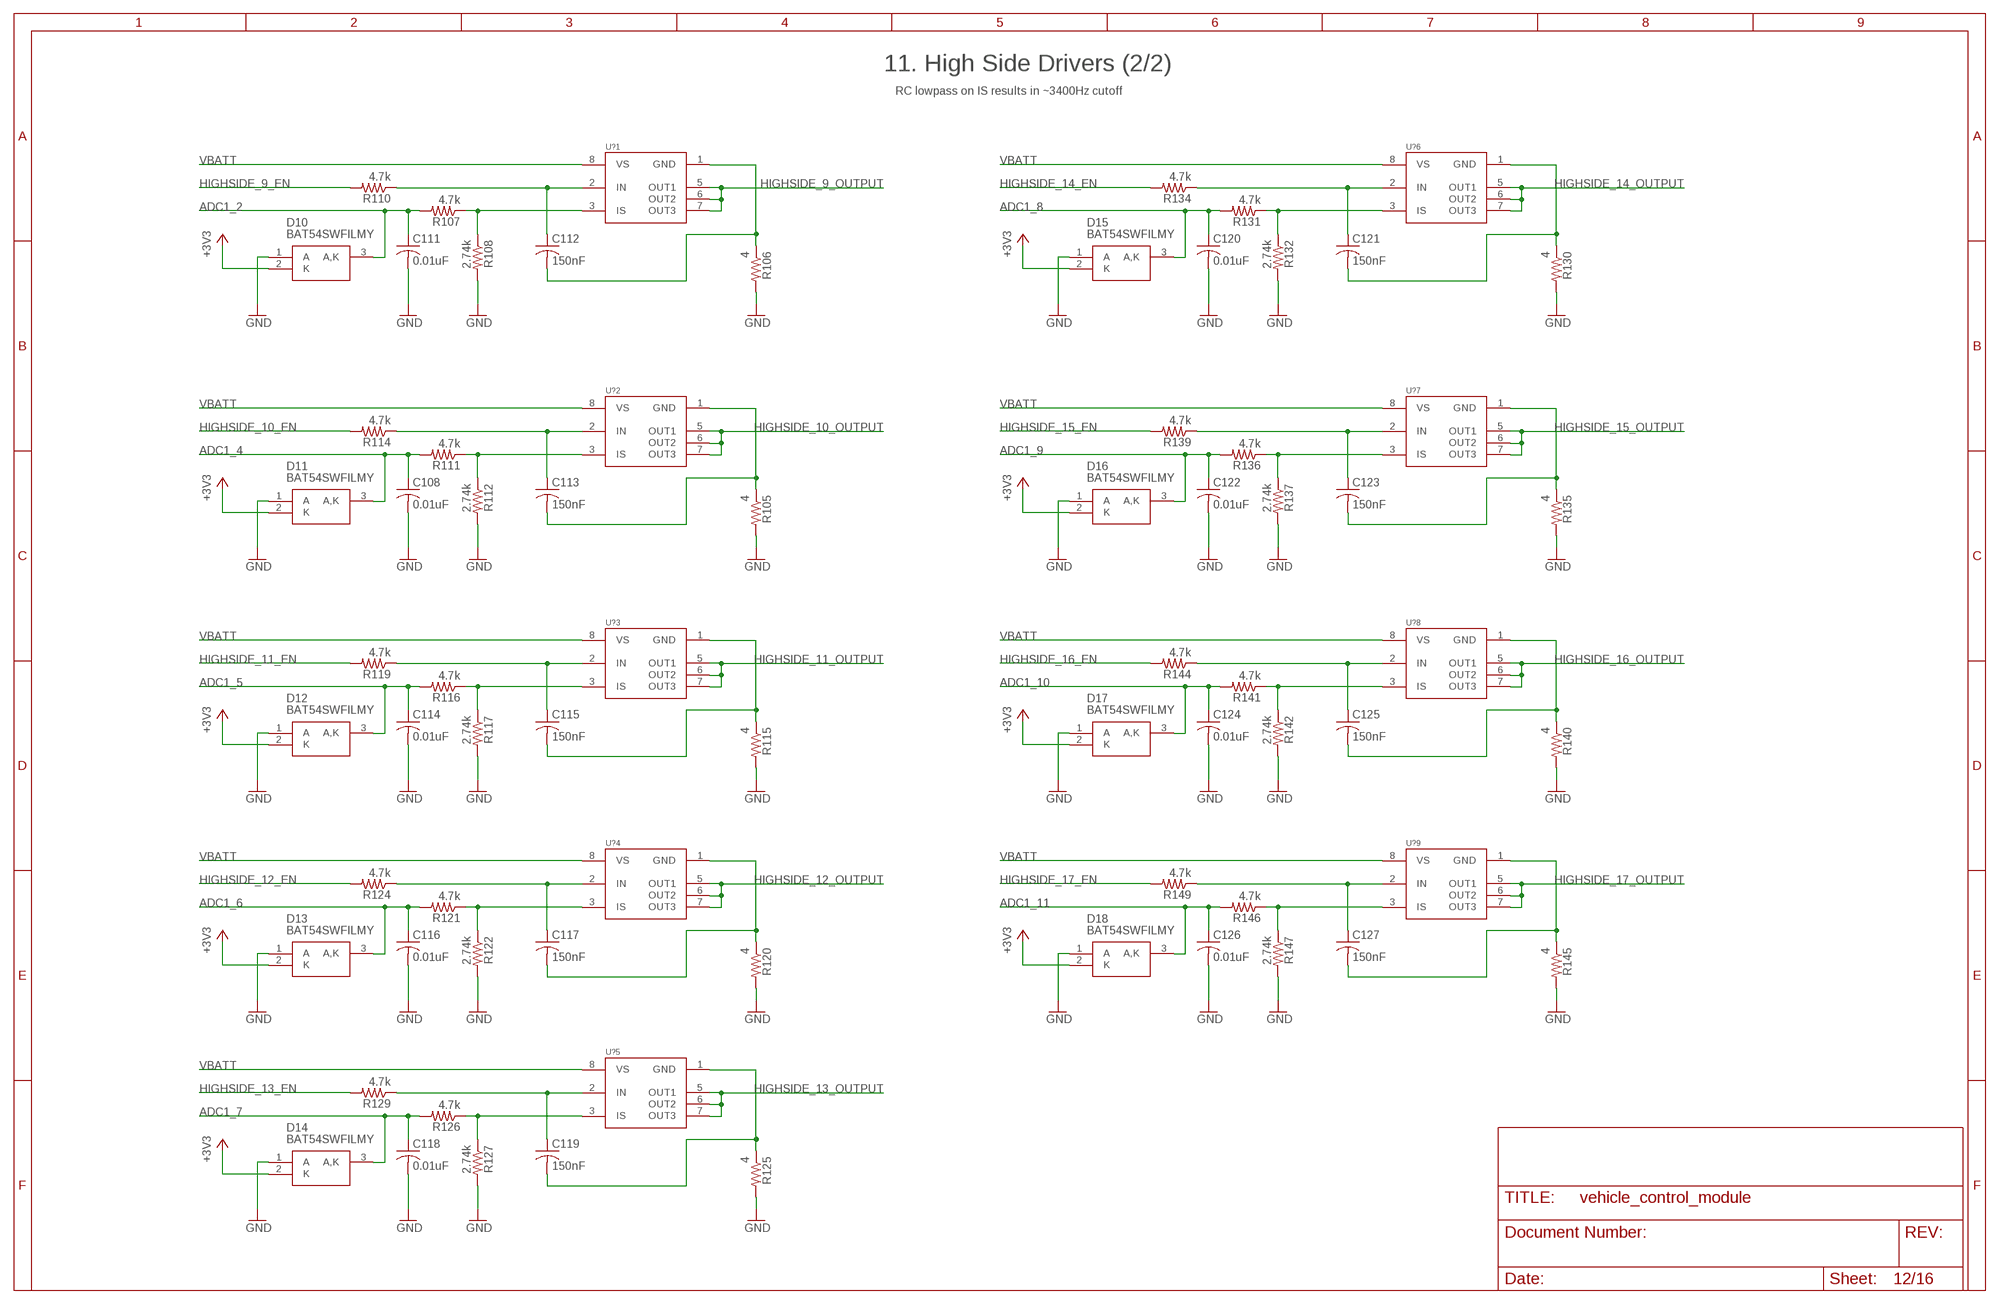
[diagram p11: schematic, sheet 12]

### Parts
C108  0.01uF  C-USC0603  [C0603]
C111  0.01uF  C-USC0603  [C0603]
C112  150nF  C-USC0603  [C0603]
C113  150nF  C-USC0603  [C0603]
C114  0.01uF  C-USC0603  [C0603]
C115  150nF  C-USC0603  [C0603]
C116  0.01uF  C-USC0603  [C0603]
C117  150nF  C-USC0603  [C0603]
C118  0.01uF  C-USC0603  [C0603]
C119  150nF  C-USC0603  [C0603]
C120  0.01uF  C-USC0603  [C0603]
C121  150nF  C-USC0603  [C0603]
C122  0.01uF  C-USC0603  [C0603]
C123  150nF  C-USC0603  [C0603]
C124  0.01uF  C-USC0603  [C0603]
C125  150nF  C-USC0603  [C0603]
C126  0.01uF  C-USC0603  [C0603]
C127  150nF  C-USC0603  [C0603]
D10  BAT54SWFILMY  [SOT65P210X110-3N]
D11  BAT54SWFILMY  [SOT65P210X110-3N]
D12  BAT54SWFILMY  [SOT65P210X110-3N]
D13  BAT54SWFILMY  [SOT65P210X110-3N]
D14  BAT54SWFILMY  [SOT65P210X110-3N]
D15  BAT54SWFILMY  [SOT65P210X110-3N]
D16  BAT54SWFILMY  [SOT65P210X110-3N]
D17  BAT54SWFILMY  [SOT65P210X110-3N]
D18  BAT54SWFILMY  [SOT65P210X110-3N]
R105  4  R-US_R1206  [R1206]
R106  4  R-US_R1206  [R1206]
R107  4.7k  R-US_R0603  [R0603]
R108  2.74k  R-US_R0603  [R0603]
R110  4.7k  R-US_R0603  [R0603]
R111  4.7k  R-US_R0603  [R0603]
R112  2.74k  R-US_R0603  [R0603]
R114  4.7k  R-US_R0603  [R0603]
R115  4  R-US_R1206  [R1206]
R116  4.7k  R-US_R0603  [R0603]
R117  2.74k  R-US_R0603  [R0603]
R119  4.7k  R-US_R0603  [R0603]
R120  4  R-US_R1206  [R1206]
R121  4.7k  R-US_R0603  [R0603]
R122  2.74k  R-US_R0603  [R0603]
R124  4.7k  R-US_R0603  [R0603]
R125  4  R-US_R1206  [R1206]
R126  4.7k  R-US_R0603  [R0603]
R127  2.74k  R-US_R0603  [R0603]
R129  4.7k  R-US_R0603  [R0603]
R130  4  R-US_R1206  [R1206]
R131  4.7k  R-US_R0603  [R0603]
R132  2.74k  R-US_R0603  [R0603]
R134  4.7k  R-US_R0603  [R0603]
R135  4  R-US_R1206  [R1206]
R136  4.7k  R-US_R0603  [R0603]
R137  2.74k  R-US_R0603  [R0603]
R139  4.7k  R-US_R0603  [R0603]
R140  4  R-US_R1206  [R1206]
R141  4.7k  R-US_R0603  [R0603]
R142  2.74k  R-US_R0603  [R0603]
R144  4.7k  R-US_R0603  [R0603]
R145  4  R-US_R1206  [R1206]
R146  4.7k  R-US_R0603  [R0603]
R147  2.74k  R-US_R0603  [R0603]
R149  4.7k  R-US_R0603  [R0603]
U?1  BTS50015-1TAD  [TO127P1500X450-7_8N-V1]
U?2  BTS50015-1TAD  [TO127P1500X450-7_8N-V1]
U?3  BTS50015-1TAD  [TO127P1500X450-7_8N-V1]
U?4  BTS50015-1TAD  [TO127P1500X450-7_8N-V1]
U?5  BTS50015-1TAD  [TO127P1500X450-7_8N-V1]
U?6  BTS50015-1TAD  [TO127P1500X450-7_8N-V1]
U?7  BTS50015-1TAD  [TO127P1500X450-7_8N-V1]
U?8  BTS50015-1TAD  [TO127P1500X450-7_8N-V1]
U?9  BTS50015-1TAD  [TO127P1500X450-7_8N-V1]

### Nets
+3V3: D10.2(K) D11.2(K) D12.2(K) D13.2(K) D14.2(K) D15.2(K) D16.2(K) D17.2(K) D18.2(K) ; also sheet 2,3,4,5,6,7,8,9,10,11,13,14,15
ADC1_2: C111.1 D10.3(A,K) R107.2 ; also sheet 3
ADC1_4: C108.1 D11.3(A,K) R111.2 ; also sheet 3
ADC1_5: C114.1 D12.3(A,K) R116.2 ; also sheet 3
ADC1_6: C116.1 D13.3(A,K) R121.2 ; also sheet 3
ADC1_7: C118.1 D14.3(A,K) R126.2 ; also sheet 3
ADC1_8: C120.1 D15.3(A,K) R131.2 ; also sheet 3
ADC1_9: C122.1 D16.3(A,K) R136.2 ; also sheet 3
ADC1_10: C124.1 D17.3(A,K) R141.2 ; also sheet 3
ADC1_11: C126.1 D18.3(A,K) R146.2 ; also sheet 3
GND: C108.2 C111.2 C114.2 C116.2 C118.2 C120.2 C122.2 C124.2 C126.2 D10.1(A) D11.1(A) D12.1(A) D13.1(A) D14.1(A) D15.1(A) D16.1(A) D17.1(A) D18.1(A) R105.2 R106.2 R108.2 R112.2 R115.2 R117.2 R120.2 R122.2 R125.2 R127.2 R130.2 R132.2 R135.2 R137.2 R140.2 R142.2 R145.2 R147.2 ; also sheet 2,3,4,5,6,7,8,9,10,11,13,14,15,16
HIGHSIDE_9_EN: R110.2 ; also sheet 3
HIGHSIDE_9_OUTPUT: U?1.5(OUT1) U?1.6(OUT2) U?1.7(OUT3)
HIGHSIDE_10_EN: R114.2 ; also sheet 3
HIGHSIDE_10_OUTPUT: U?2.5(OUT1) U?2.6(OUT2) U?2.7(OUT3)
HIGHSIDE_11_EN: R119.2 ; also sheet 3
HIGHSIDE_11_OUTPUT: U?3.5(OUT1) U?3.6(OUT2) U?3.7(OUT3)
HIGHSIDE_12_EN: R124.2 ; also sheet 3
HIGHSIDE_12_OUTPUT: U?4.5(OUT1) U?4.6(OUT2) U?4.7(OUT3)
HIGHSIDE_13_EN: R129.2 ; also sheet 3
HIGHSIDE_13_OUTPUT: U?5.5(OUT1) U?5.6(OUT2) U?5.7(OUT3)
HIGHSIDE_14_EN: R134.2 ; also sheet 3
HIGHSIDE_14_OUTPUT: U?6.5(OUT1) U?6.6(OUT2) U?6.7(OUT3)
HIGHSIDE_15_EN: R139.2 ; also sheet 3
HIGHSIDE_15_OUTPUT: U?7.5(OUT1) U?7.6(OUT2) U?7.7(OUT3)
HIGHSIDE_16_EN: R144.2 ; also sheet 3
HIGHSIDE_16_OUTPUT: U?8.5(OUT1) U?8.6(OUT2) U?8.7(OUT3)
HIGHSIDE_17_EN: R149.2 ; also sheet 3
HIGHSIDE_17_OUTPUT: U?9.5(OUT1) U?9.6(OUT2) U?9.7(OUT3)
N$94: C112.2 R106.1 U?1.1(GND)
N$95: R107.1 R108.1 U?1.3(IS)
N$96: C113.2 R105.1 U?2.1(GND)
N$97: C112.1 R110.1 U?1.2(IN)
N$98: R111.1 R112.1 U?2.3(IS)
N$99: C113.1 R114.1 U?2.2(IN)
N$100: C115.2 R115.1 U?3.1(GND)
N$101: R116.1 R117.1 U?3.3(IS)
N$102: C115.1 R119.1 U?3.2(IN)
N$103: C117.2 R120.1 U?4.1(GND)
N$104: R121.1 R122.1 U?4.3(IS)
N$105: C117.1 R124.1 U?4.2(IN)
N$106: C119.2 R125.1 U?5.1(GND)
N$107: R126.1 R127.1 U?5.3(IS)
N$108: C119.1 R129.1 U?5.2(IN)
N$109: C121.2 R130.1 U?6.1(GND)
N$110: R131.1 R132.1 U?6.3(IS)
N$111: C121.1 R134.1 U?6.2(IN)
N$112: C123.2 R135.1 U?7.1(GND)
N$113: R136.1 R137.1 U?7.3(IS)
N$114: C123.1 R139.1 U?7.2(IN)
N$115: C125.2 R140.1 U?8.1(GND)
N$116: R141.1 R142.1 U?8.3(IS)
N$117: C125.1 R144.1 U?8.2(IN)
N$118: C127.2 R145.1 U?9.1(GND)
N$119: R146.1 R147.1 U?9.3(IS)
N$120: C127.1 R149.1 U?9.2(IN)
VBATT: U?1.8(VS) U?2.8(VS) U?3.8(VS) U?4.8(VS) U?5.8(VS) U?6.8(VS) U?7.8(VS) U?8.8(VS) U?9.8(VS) ; also sheet 2,11

### Notes on the sheet
- 11. High Side Drivers (2/2)
- RC lowpass on IS results in ~3400Hz cutoff

## Sheet 13 of 16
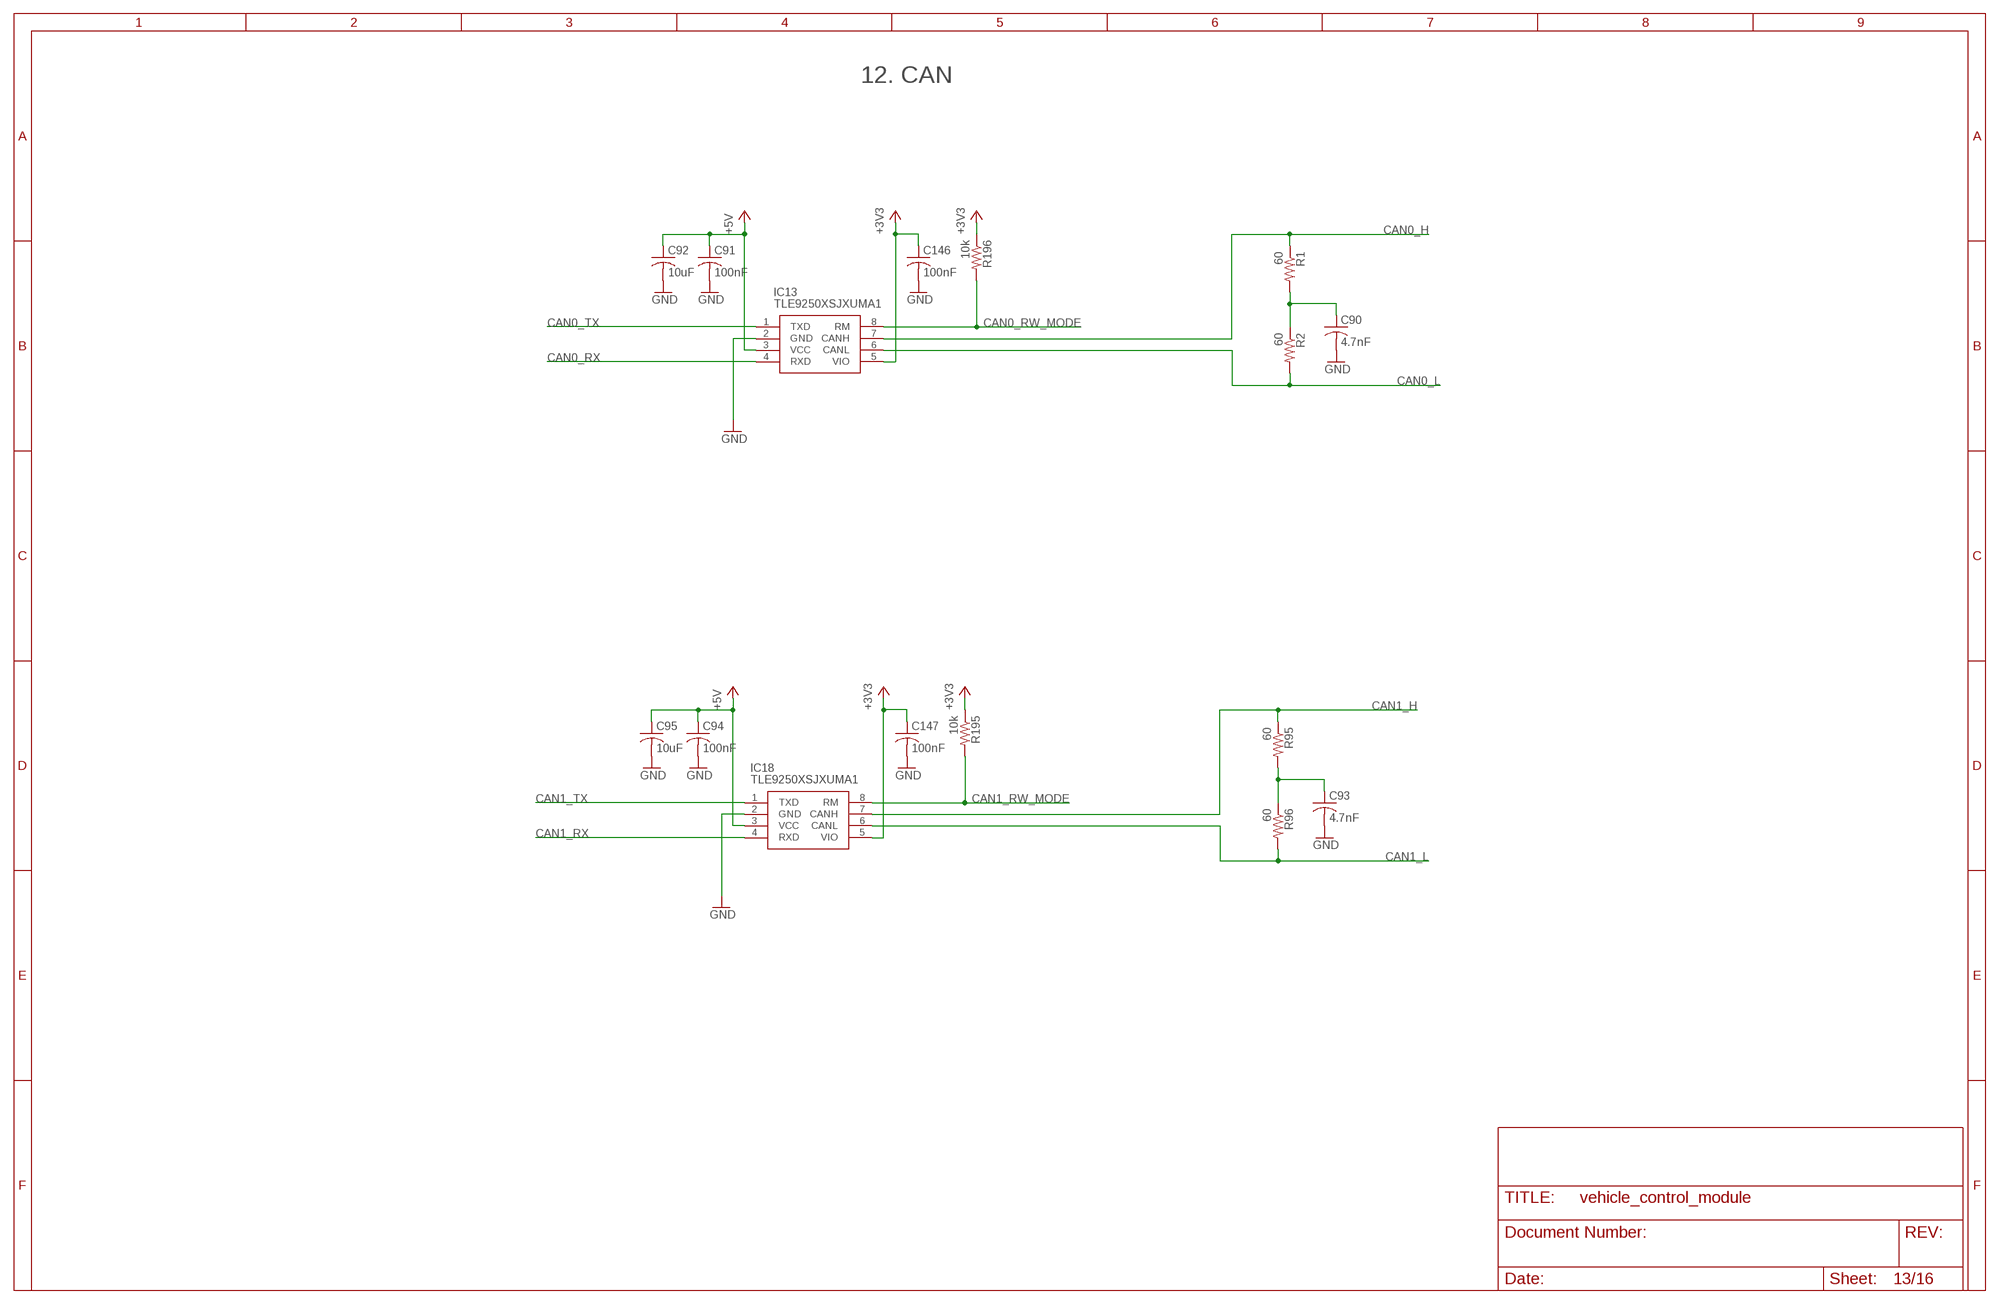
[diagram p12: schematic, sheet 13]

### Parts
C90  4.7nF  C-USC0603  [C0603]
C91  100nF  C-USC0603  [C0603]
C92  10uF  C-USC0603  [C0603]
C93  4.7nF  C-USC0603  [C0603]
C94  100nF  C-USC0603  [C0603]
C95  10uF  C-USC0603  [C0603]
C146  100nF  C-USC0603  [C0603]
C147  100nF  C-USC0603  [C0603]
IC13  TLE9250XSJXUMA1  [SOIC127P602X173-8N]
IC18  TLE9250XSJXUMA1  [SOIC127P602X173-8N]
R1  60  R-US_R0805  [R0805]
R2  60  R-US_R0805  [R0805]
R95  60  R-US_R0805  [R0805]
R96  60  R-US_R0805  [R0805]
R195  10k  R-US_R0603  [R0603]
R196  10k  R-US_R0603  [R0603]

### Nets
+3V3: C146.1 C147.1 IC13.5(VIO) IC18.5(VIO) R195.1 R196.1 ; also sheet 2,3,4,5,6,7,8,9,10,11,12,14,15
+5V: C91.1 C92.1 C94.1 C95.1 IC13.3(VCC) IC18.3(VCC) ; also sheet 2
CAN0_H: IC13.7(CANH) R1.1
CAN0_L: IC13.6(CANL) R2.2
CAN0_RW_MODE: IC13.8(RM) R196.2 ; also sheet 3
CAN0_RX: IC13.4(RXD) ; also sheet 3
CAN0_TX: IC13.1(TXD) ; also sheet 3
CAN1_H: IC18.7(CANH) R95.1
CAN1_L: IC18.6(CANL) R96.2
CAN1_RW_MODE: IC18.8(RM) R195.2 ; also sheet 3
CAN1_RX: IC18.4(RXD) ; also sheet 3
CAN1_TX: IC18.1(TXD) ; also sheet 3
GND: C90.2 C91.2 C92.2 C93.2 C94.2 C95.2 C146.2 C147.2 IC13.2(GND) IC18.2(GND) ; also sheet 2,3,4,5,6,7,8,9,10,11,12,14,15,16
N$3: C93.1 R95.2 R96.1
N$82: C90.1 R1.2 R2.1

### Notes on the sheet
- 12. CAN

## Sheet 14 of 16
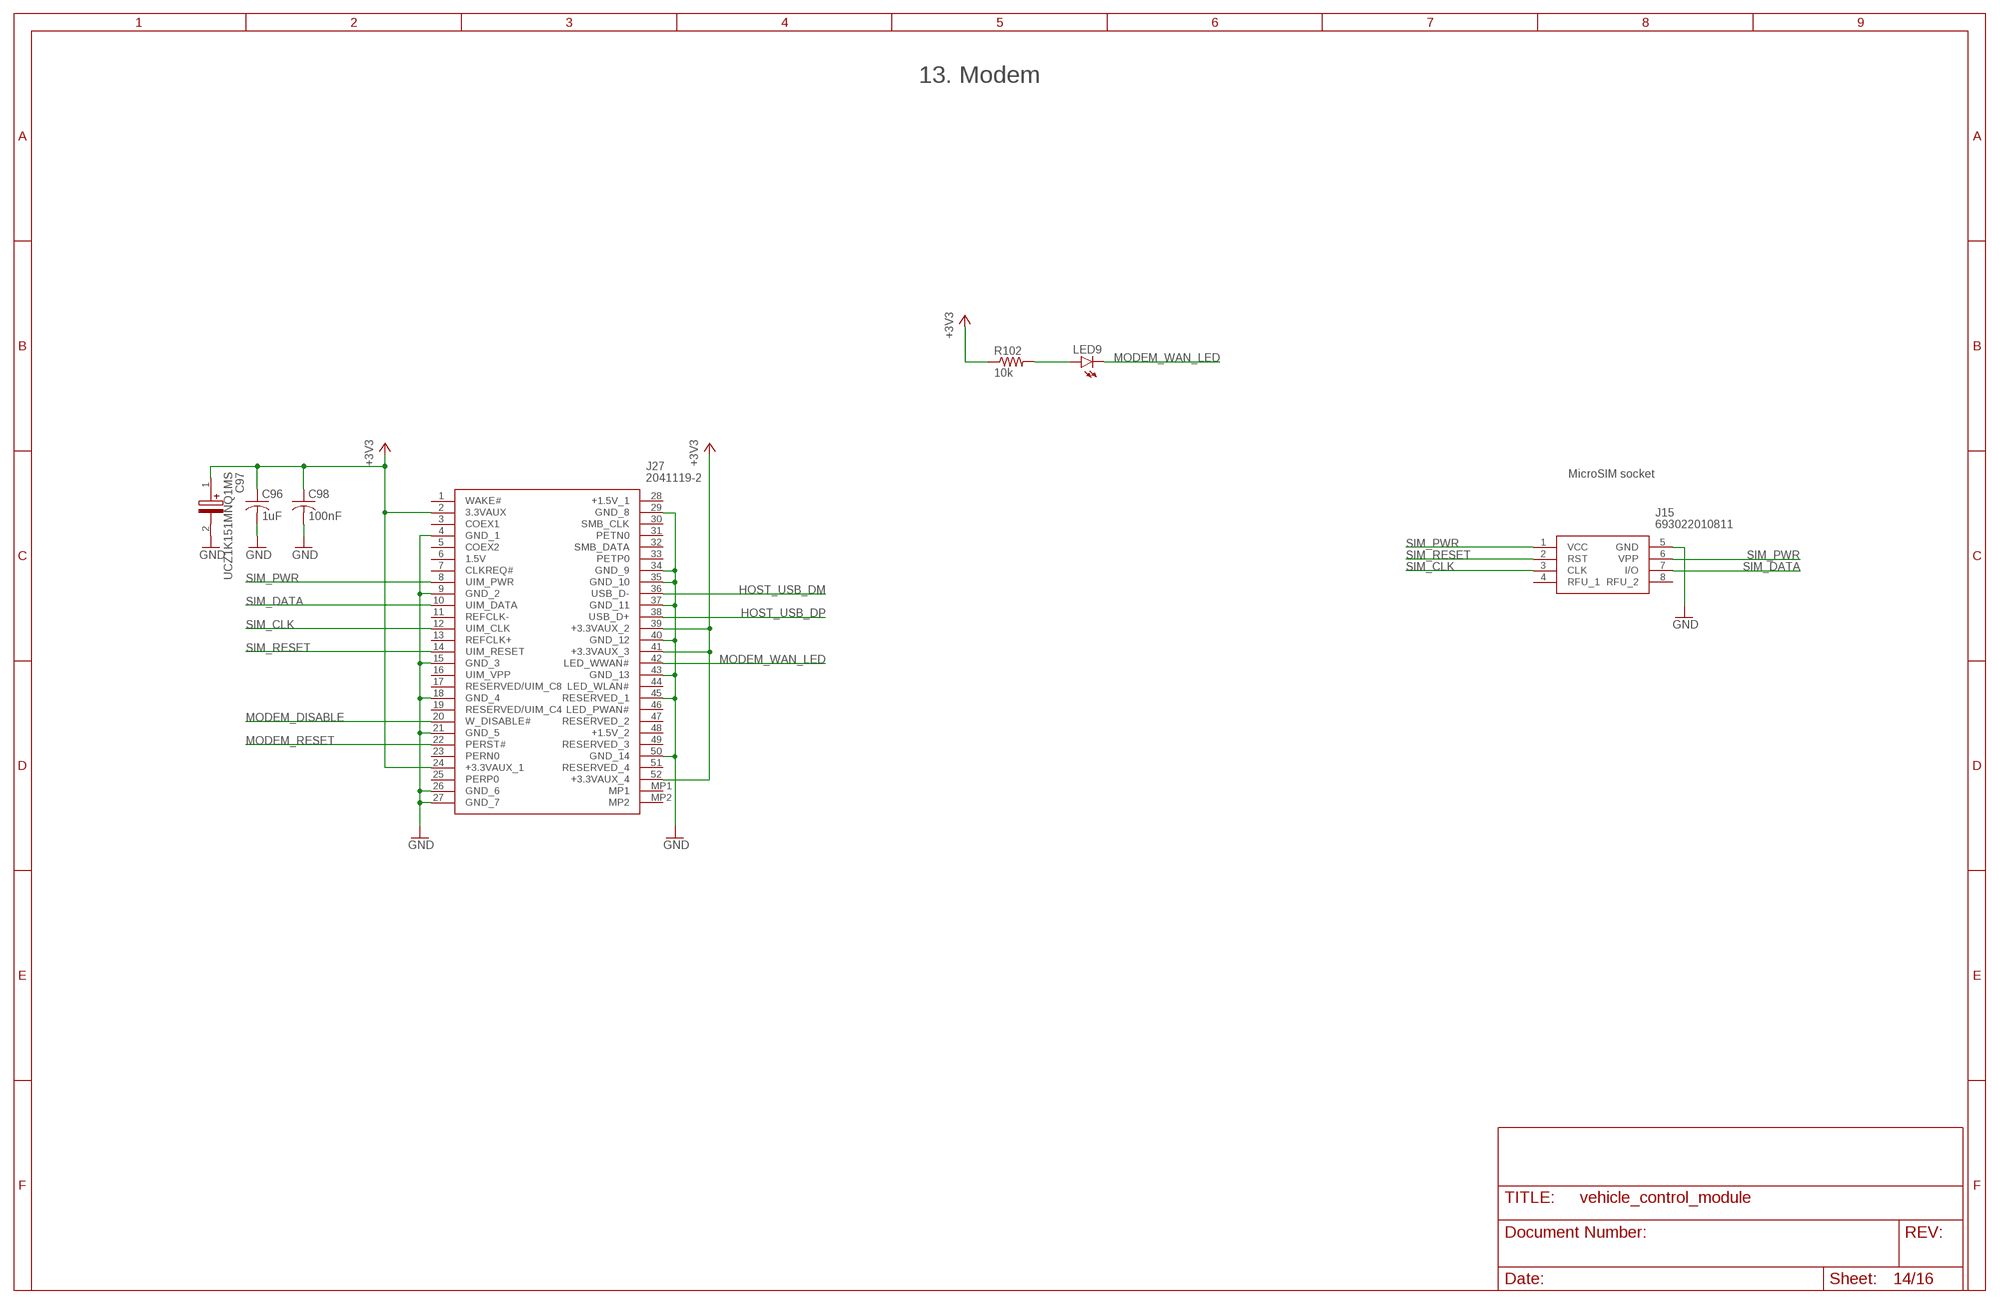
[diagram p13: schematic, sheet 14]

### Parts
C96  1uF  C-USC0603  [C0603]
C97  UCZ1K151MNQ1MS  [CAPAE1360X1450N]
C98  100nF  C-USC0603  [C0603]
J15  693022010811  [693022010811]
J27  2041119-2  [20411192]
LED9  LEDCHIPLED_0603  [CHIPLED_0603]
R102  10k  R-US_R0603  [R0603]

### Nets
+3V3: C96.1 C97.1(+) C98.1 J27.2(3.3VAUX) J27.24(+3.3VAUX_1) J27.39(+3.3VAUX_2) J27.41(+3.3VAUX_3) J27.52(+3.3VAUX_4) R102.1 ; also sheet 2,3,4,5,6,7,8,9,10,11,12,13,15
GND: C96.2 C97.2(-) C98.2 J15.5(GND) J27.4(GND_1) J27.9(GND_2) J27.15(GND_3) J27.18(GND_4) J27.21(GND_5) J27.26(GND_6) J27.27(GND_7) J27.29(GND_8) J27.34(GND_9) J27.35(GND_10) J27.37(GND_11) J27.40(GND_12) J27.43(GND_13) J27.45(RESERVED_1) J27.50(GND_14) ; also sheet 2,3,4,5,6,7,8,9,10,11,12,13,15,16
HOST_USB_DM: J27.36(USB_D-) ; also sheet 3
HOST_USB_DP: J27.38(USB_D+) ; also sheet 3
MODEM_DISABLE: J27.20(W_DISABLE#) ; also sheet 3
MODEM_RESET: J27.22(PERST#) ; also sheet 3
MODEM_WAN_LED: J27.42(LED_WWAN#) LED9.C
N$92: LED9.A R102.2
SIM_CLK: J15.3(CLK) J27.12(UIM_CLK)
SIM_DATA: J15.7(I/O) J27.10(UIM_DATA)
SIM_PWR: J15.1(VCC) J15.6(VPP) J27.8(UIM_PWR)
SIM_RESET: J15.2(RST) J27.14(UIM_RESET)
Unconnected: J15.4(RFU_1) J15.8(RFU_2) J27.1(WAKE#) J27.3(COEX1) J27.5(COEX2) J27.6(1.5V) J27.7(CLKREQ#) J27.11(REFCLK-) J27.13(REFCLK+) J27.16(UIM_VPP) J27.17(RESERVED/UIM_C8) J27.19(RESERVED/UIM_C4) J27.23(PERN0) J27.25(PERP0) J27.28(+1.5V_1) J27.30(SMB_CLK) J27.31(PETN0) J27.32(SMB_DATA) J27.33(PETP0) J27.44(LED_WLAN#) J27.46(LED_PWAN#) J27.47(RESERVED_2) J27.48(+1.5V_2) J27.49(RESERVED_3) J27.51(RESERVED_4) J27.MP1 J27.MP2

### Notes on the sheet
- 13. Modem
- MicroSIM socket

## Sheet 15 of 16
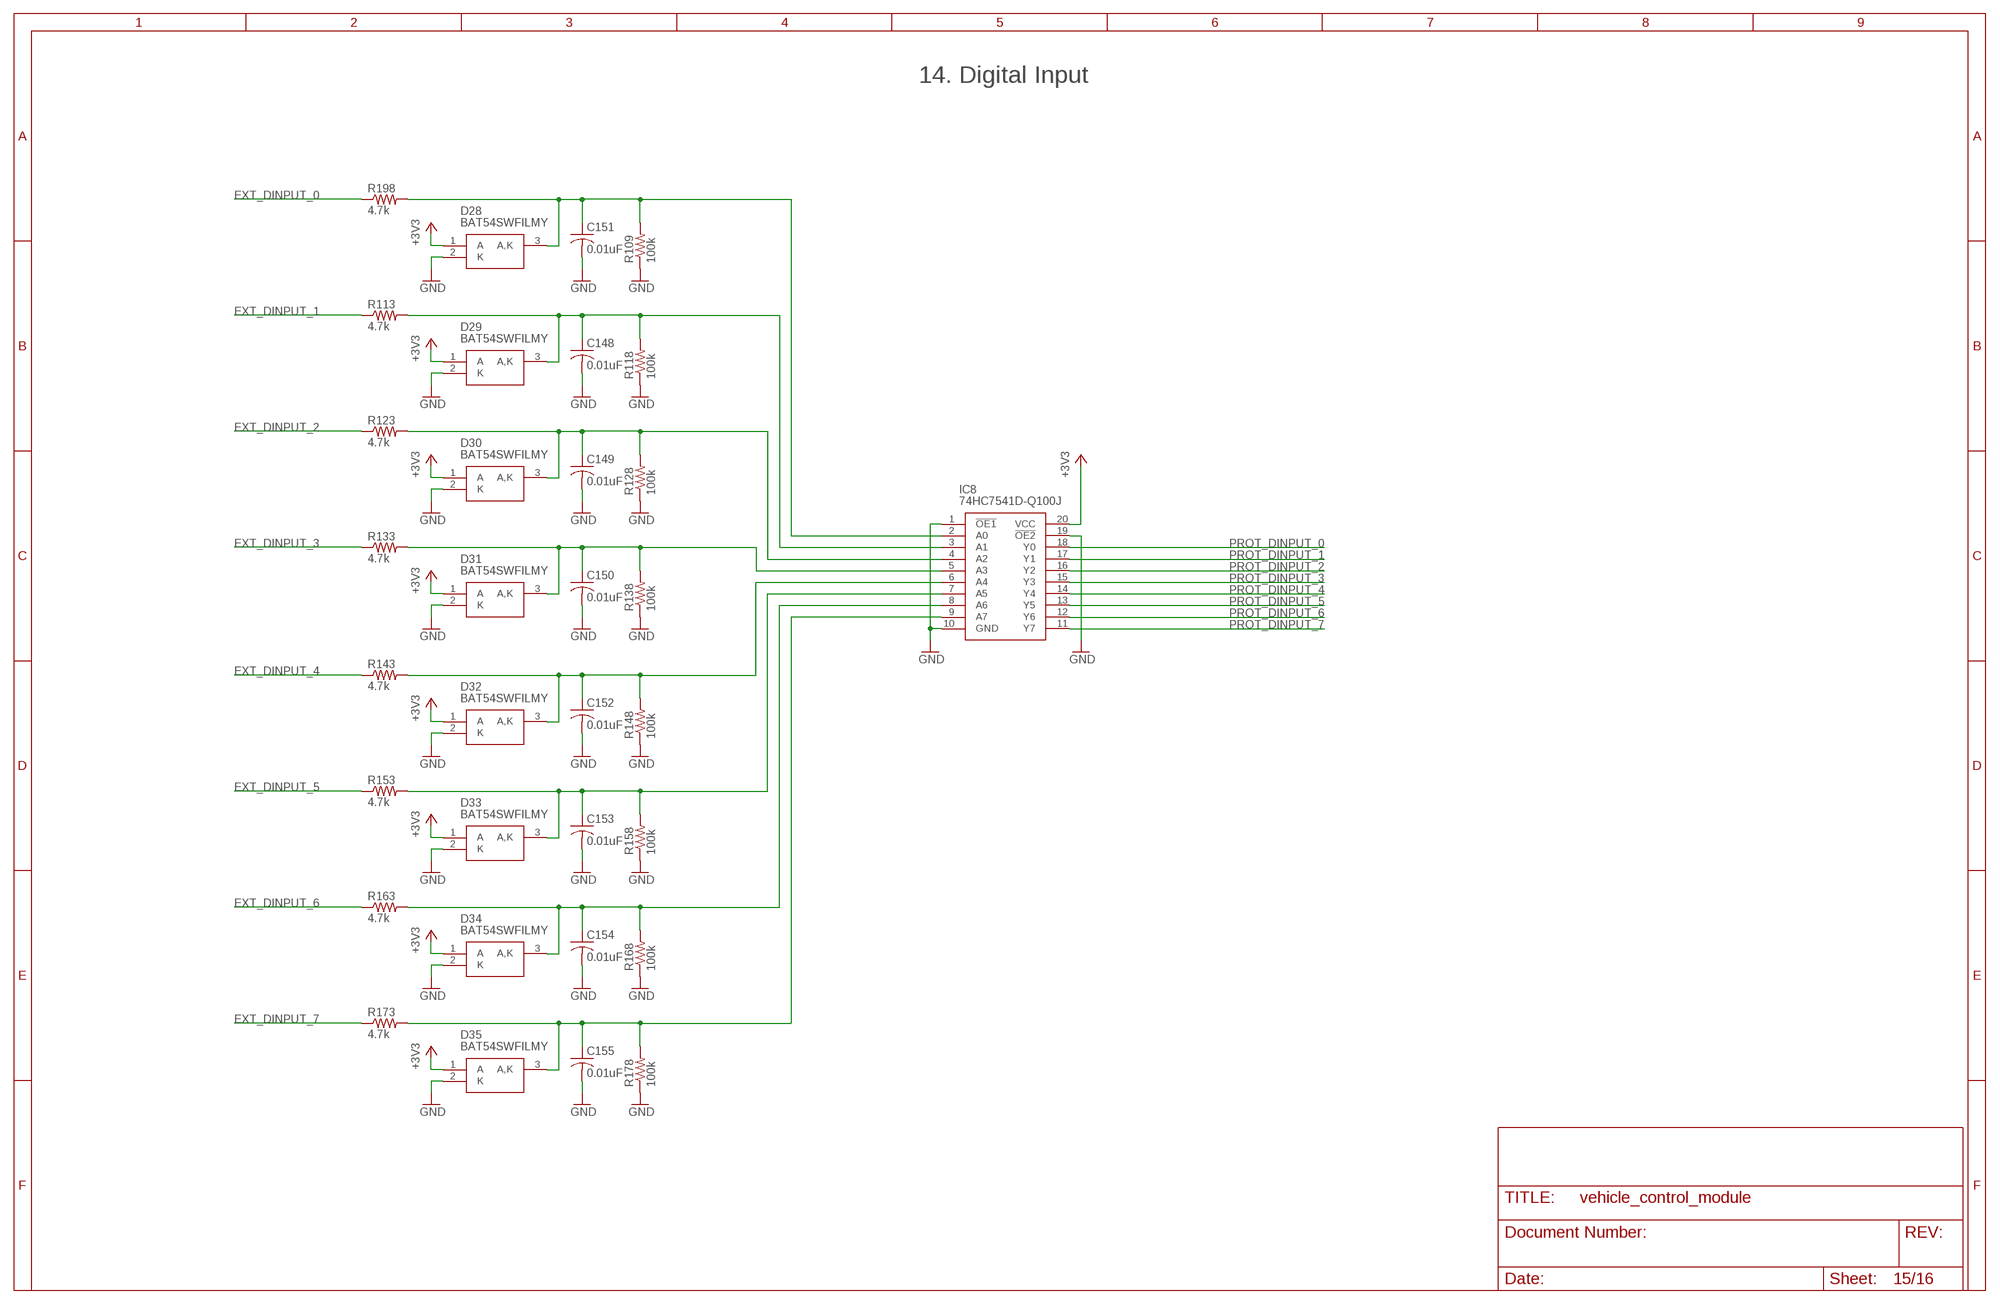
[diagram p14: schematic, sheet 15]

### Parts
C148  0.01uF  C-USC0603  [C0603]
C149  0.01uF  C-USC0603  [C0603]
C150  0.01uF  C-USC0603  [C0603]
C151  0.01uF  C-USC0603  [C0603]
C152  0.01uF  C-USC0603  [C0603]
C153  0.01uF  C-USC0603  [C0603]
C154  0.01uF  C-USC0603  [C0603]
C155  0.01uF  C-USC0603  [C0603]
D28  BAT54SWFILMY  [SOT65P210X110-3N]
D29  BAT54SWFILMY  [SOT65P210X110-3N]
D30  BAT54SWFILMY  [SOT65P210X110-3N]
D31  BAT54SWFILMY  [SOT65P210X110-3N]
D32  BAT54SWFILMY  [SOT65P210X110-3N]
D33  BAT54SWFILMY  [SOT65P210X110-3N]
D34  BAT54SWFILMY  [SOT65P210X110-3N]
D35  BAT54SWFILMY  [SOT65P210X110-3N]
IC8  74HC7541D-Q100J  [SOIC127P1032X265-20N]
R109  100k  R-US_R0603  [R0603]
R113  4.7k  R-US_R0603  [R0603]
R118  100k  R-US_R0603  [R0603]
R123  4.7k  R-US_R0603  [R0603]
R128  100k  R-US_R0603  [R0603]
R133  4.7k  R-US_R0603  [R0603]
R138  100k  R-US_R0603  [R0603]
R143  4.7k  R-US_R0603  [R0603]
R148  100k  R-US_R0603  [R0603]
R153  4.7k  R-US_R0603  [R0603]
R158  100k  R-US_R0603  [R0603]
R163  4.7k  R-US_R0603  [R0603]
R168  100k  R-US_R0603  [R0603]
R173  4.7k  R-US_R0603  [R0603]
R178  100k  R-US_R0603  [R0603]
R198  4.7k  R-US_R0603  [R0603]

### Nets
+3V3: D28.1(A) D29.1(A) D30.1(A) D31.1(A) D32.1(A) D33.1(A) D34.1(A) D35.1(A) IC8.20(VCC) ; also sheet 2,3,4,5,6,7,8,9,10,11,12,13,14
EXT_DINPUT_0: R198.1
EXT_DINPUT_1: R113.1
EXT_DINPUT_2: R123.1
EXT_DINPUT_3: R133.1
EXT_DINPUT_4: R143.1
EXT_DINPUT_5: R153.1
EXT_DINPUT_6: R163.1
EXT_DINPUT_7: R173.1
GND: C148.2 C149.2 C150.2 C151.2 C152.2 C153.2 C154.2 C155.2 D28.2(K) D29.2(K) D30.2(K) D31.2(K) D32.2(K) D33.2(K) D34.2(K) D35.2(K) IC8.1(!OE1) IC8.10(GND) IC8.19(!OE2) R109.1 R118.1 R128.1 R138.1 R148.1 R158.1 R168.1 R178.1 ; also sheet 2,3,4,5,6,7,8,9,10,11,12,13,14,16
N$148: C148.1 D29.3(A,K) IC8.3(A1) R113.2 R118.2
N$149: C149.1 D30.3(A,K) IC8.4(A2) R123.2 R128.2
N$150: C150.1 D31.3(A,K) IC8.5(A3) R133.2 R138.2
N$151: C151.1 D28.3(A,K) IC8.2(A0) R109.2 R198.2
N$152: C152.1 D32.3(A,K) IC8.6(A4) R143.2 R148.2
N$153: C153.1 D33.3(A,K) IC8.7(A5) R153.2 R158.2
N$154: C154.1 D34.3(A,K) IC8.8(A6) R163.2 R168.2
N$155: C155.1 D35.3(A,K) IC8.9(A7) R173.2 R178.2
PROT_DINPUT_0: IC8.18(Y0) ; also sheet 3
PROT_DINPUT_1: IC8.17(Y1) ; also sheet 3
PROT_DINPUT_2: IC8.16(Y2) ; also sheet 3
PROT_DINPUT_3: IC8.15(Y3) ; also sheet 3
PROT_DINPUT_4: IC8.14(Y4) ; also sheet 3
PROT_DINPUT_5: IC8.13(Y5) ; also sheet 3
PROT_DINPUT_6: IC8.12(Y6) ; also sheet 3
PROT_DINPUT_7: IC8.11(Y7) ; also sheet 3

### Notes on the sheet
- 14. Digital Input